# EasyEDA Pro project RCKid.epro, schematic RCKid

## Sheets
1 Power: Board Name: RCKid; Create Date: 2025-07-24; Page Name: Power; Project Name: rckid-III; Schematic Name: RCKid; Update Date: 2025-07-24; Company: EasyEDA.com; Drawed: EasyEDAPro; Page Size: A4; Part Number: JLCPCB-002; Reviewed: EasyEDAPro; Version: V0.1
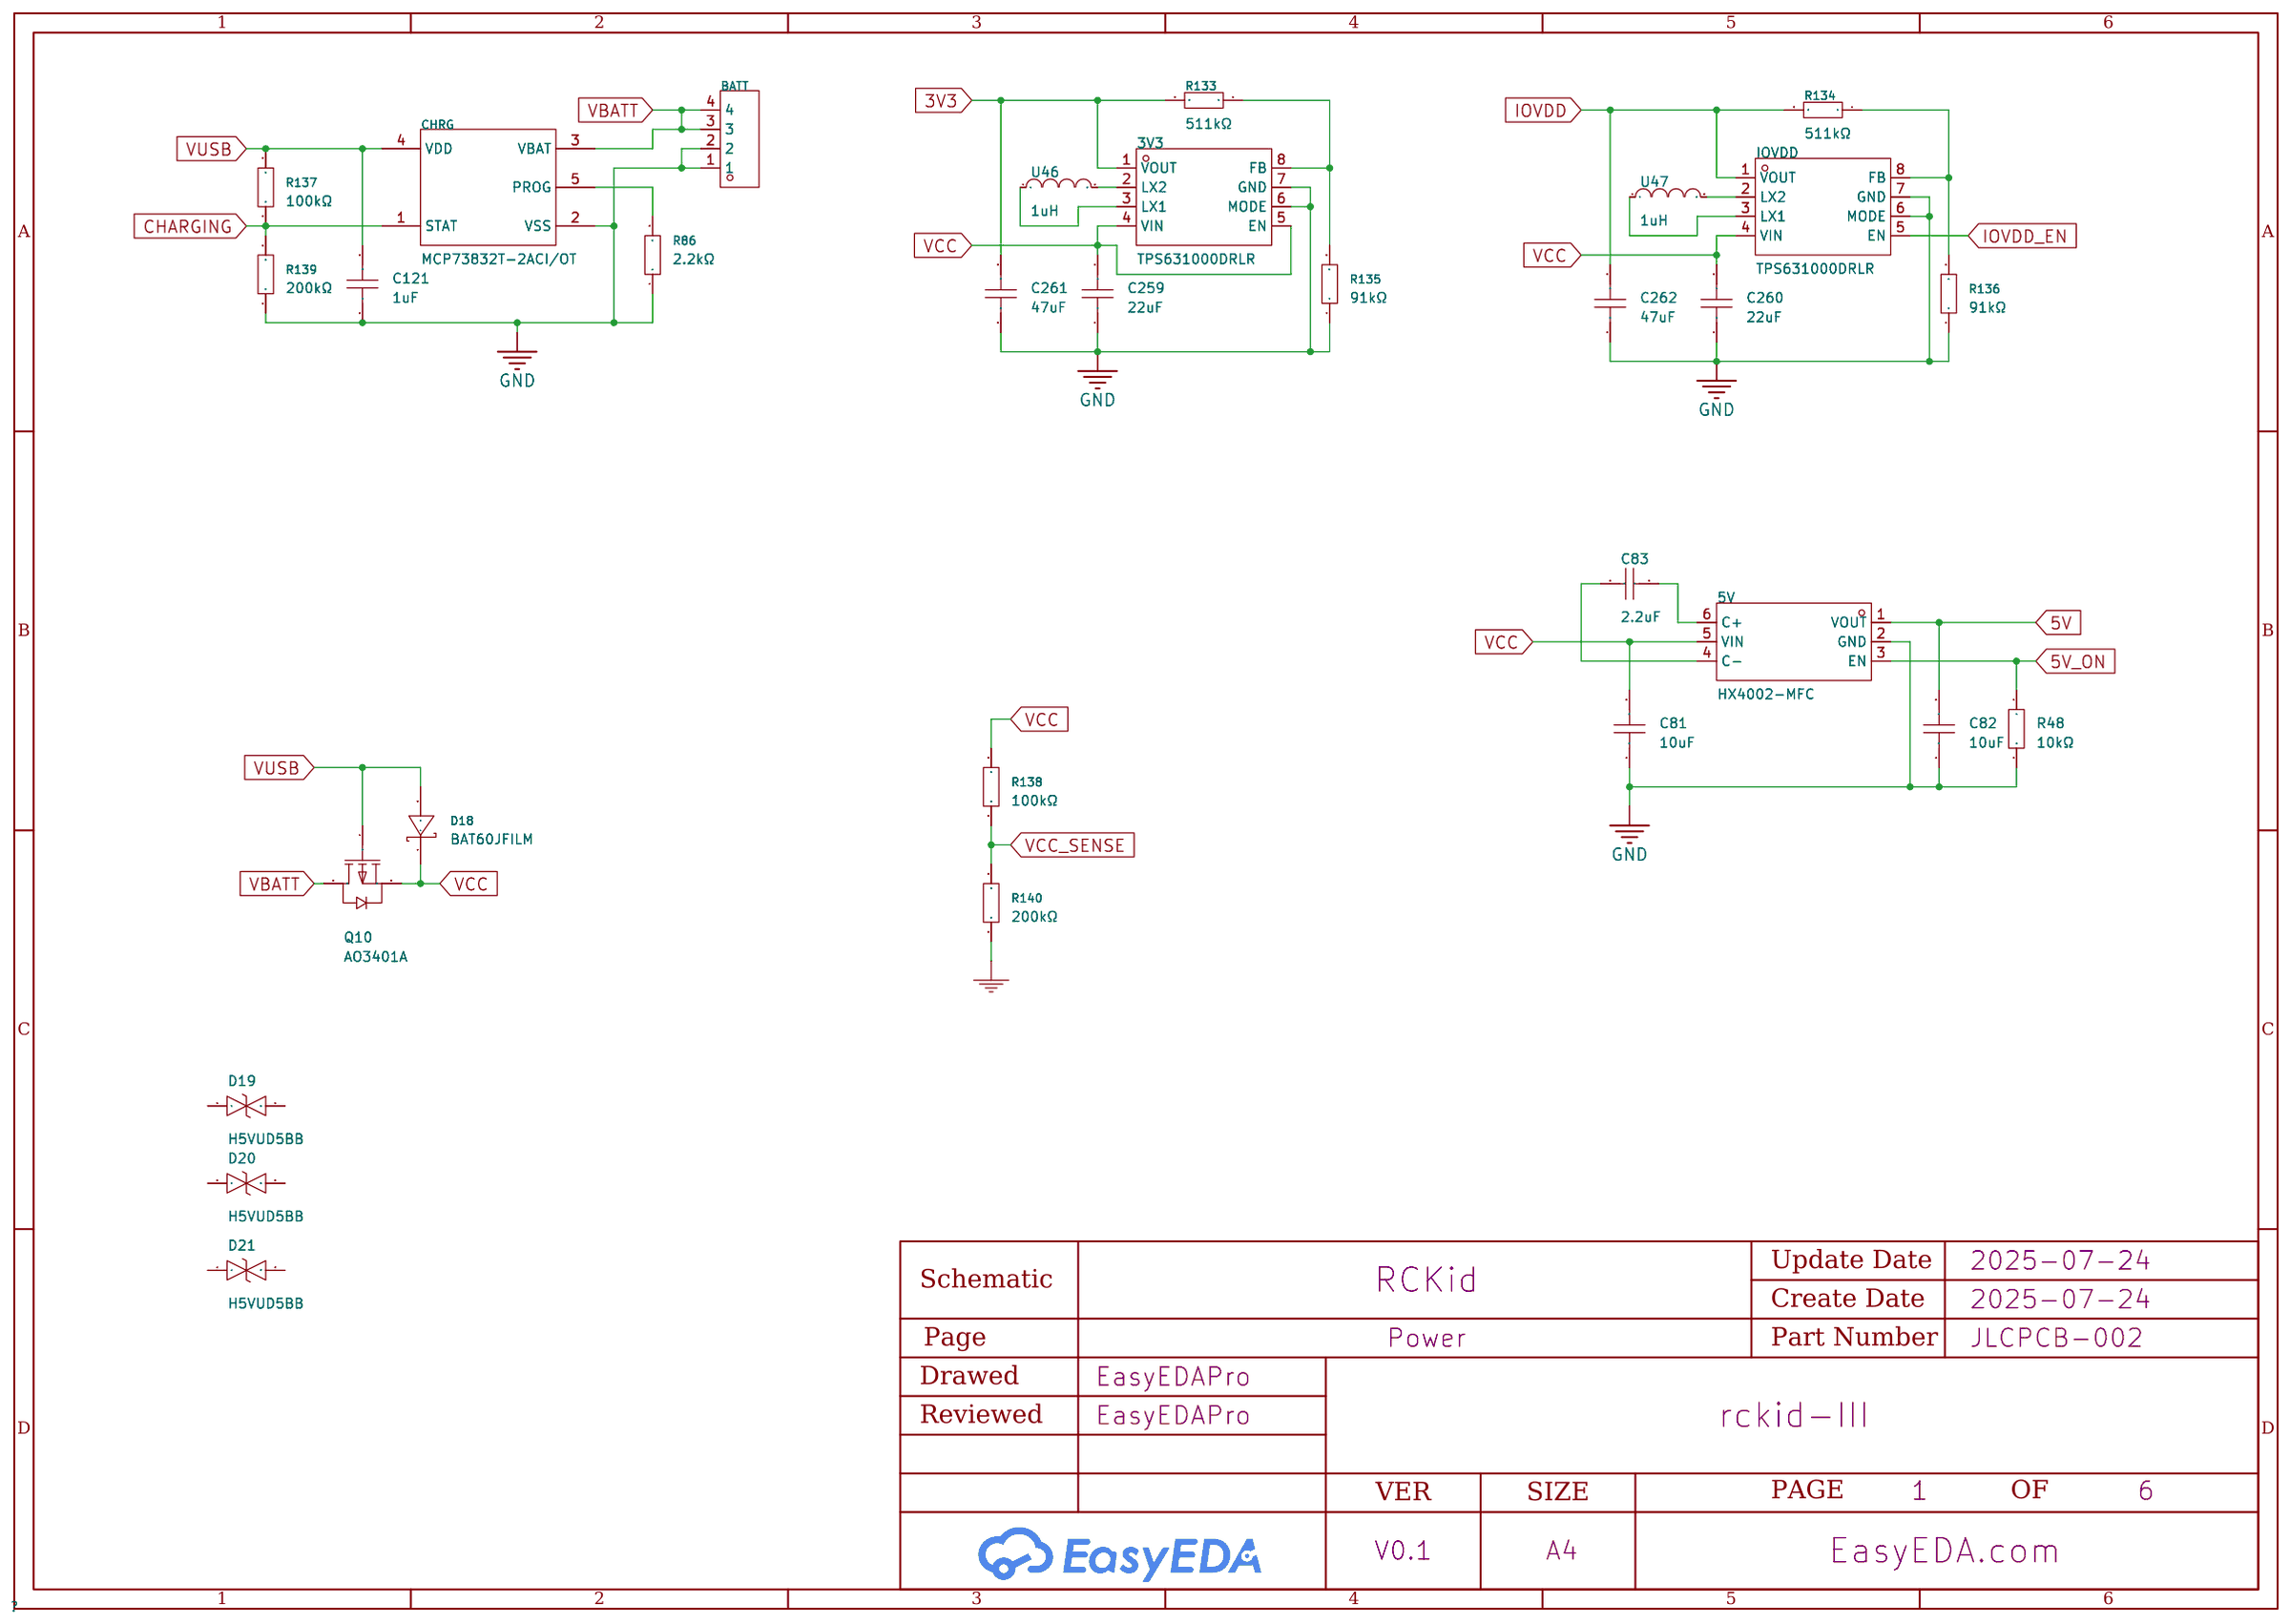
[diagram p13: Power]
2 Logic: Page Name: Logic; Update Date: 2025-07-25
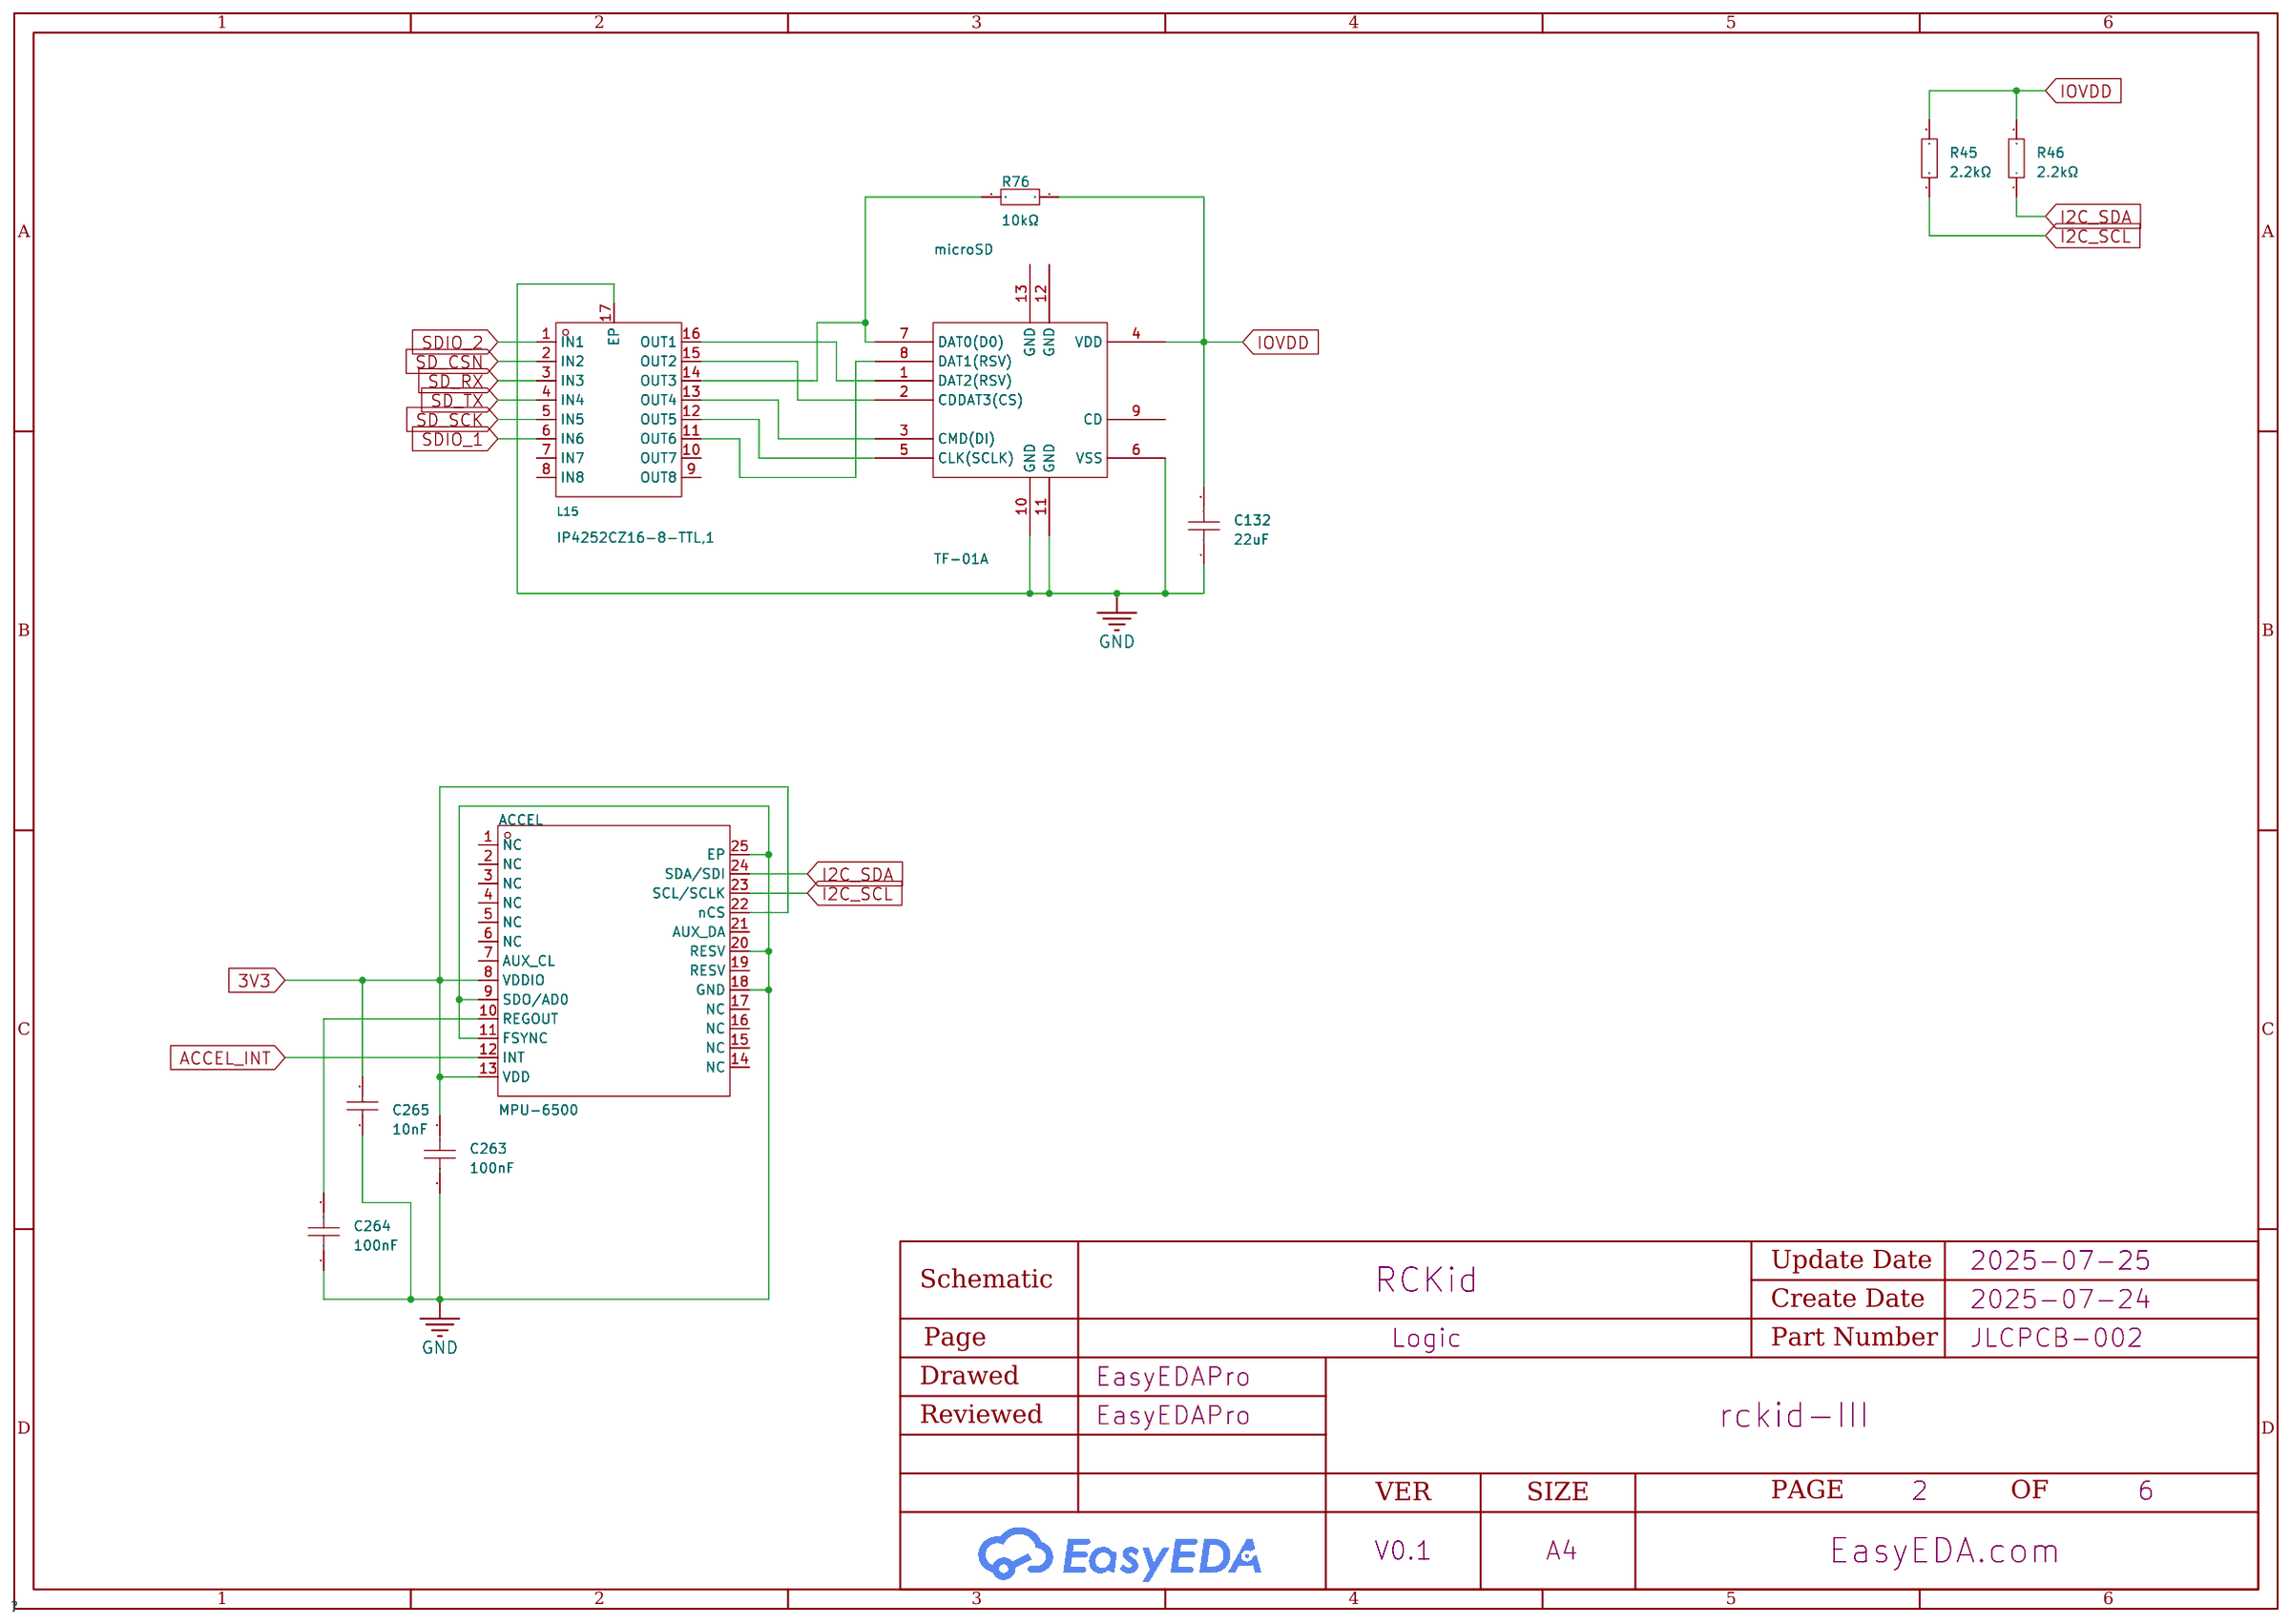
[diagram p14: Logic]
3 Audio: Page Name: Audio; Update Date: 2025-07-25
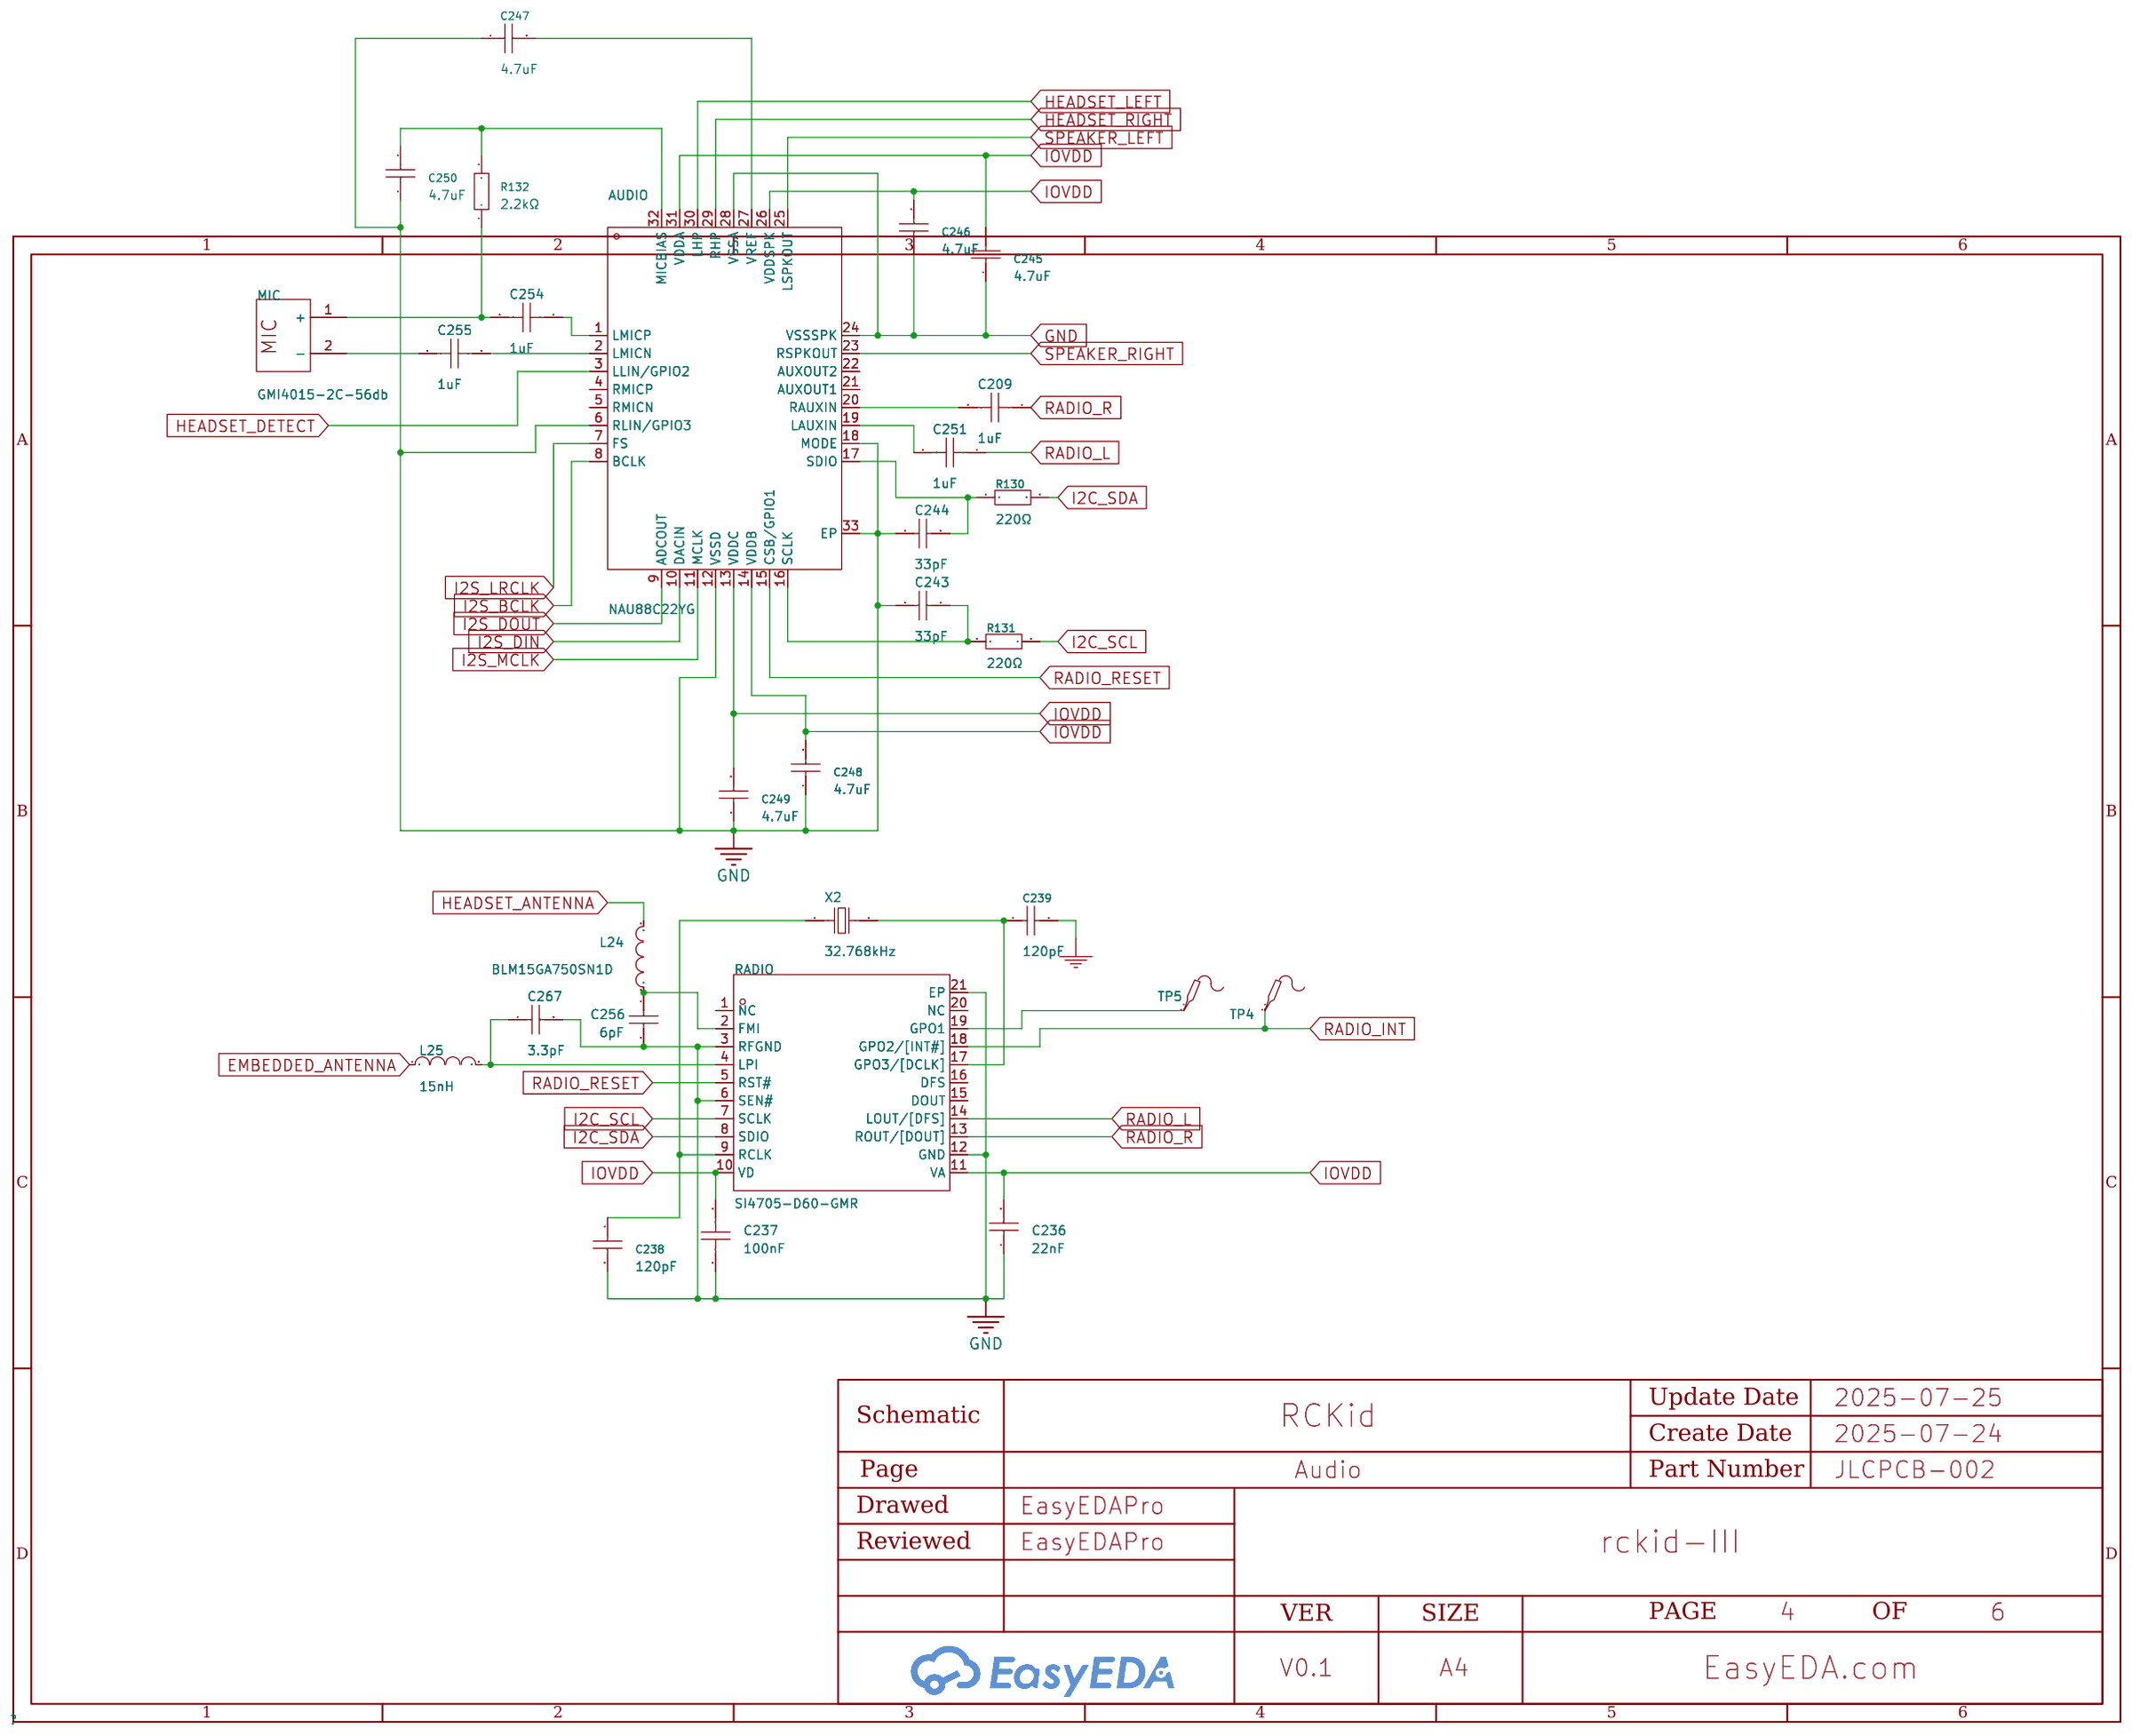
[diagram p15: Audio]
4 IO: Page Name: IO; Update Date: 2025-07-26
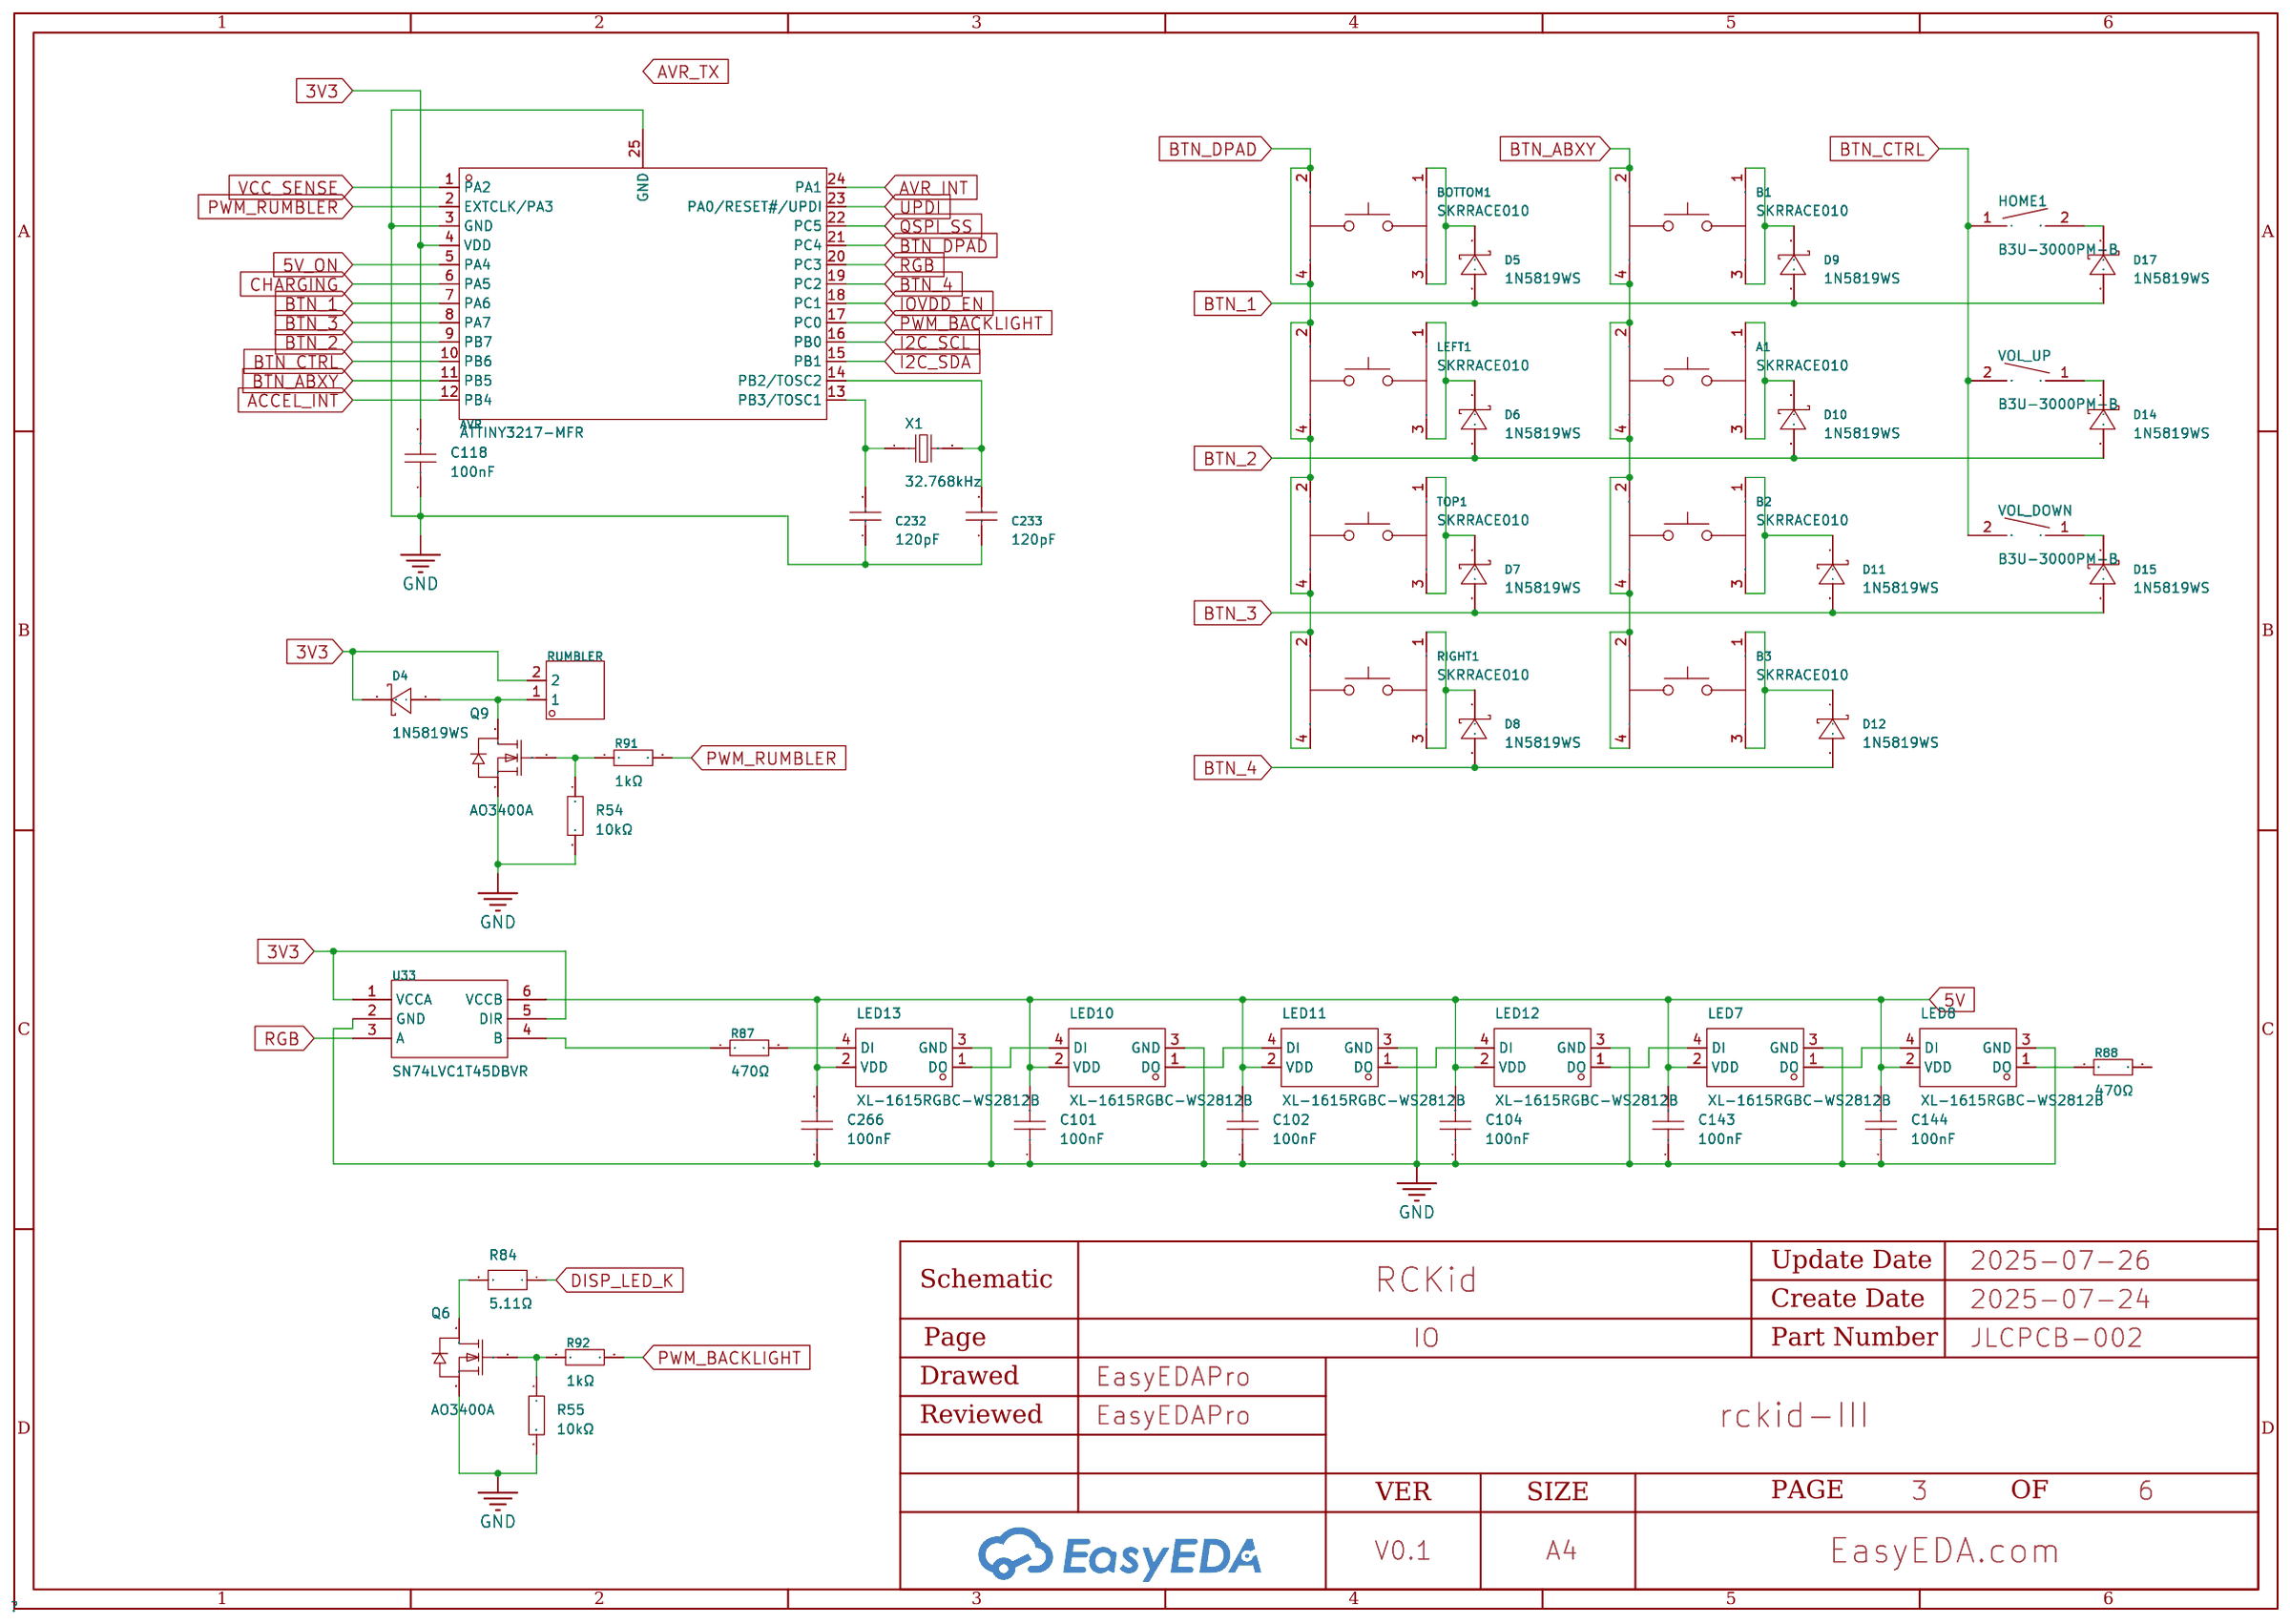
[diagram p16: IO]
5 Connectors: Page Name: Connectors; Update Date: 2025-07-27
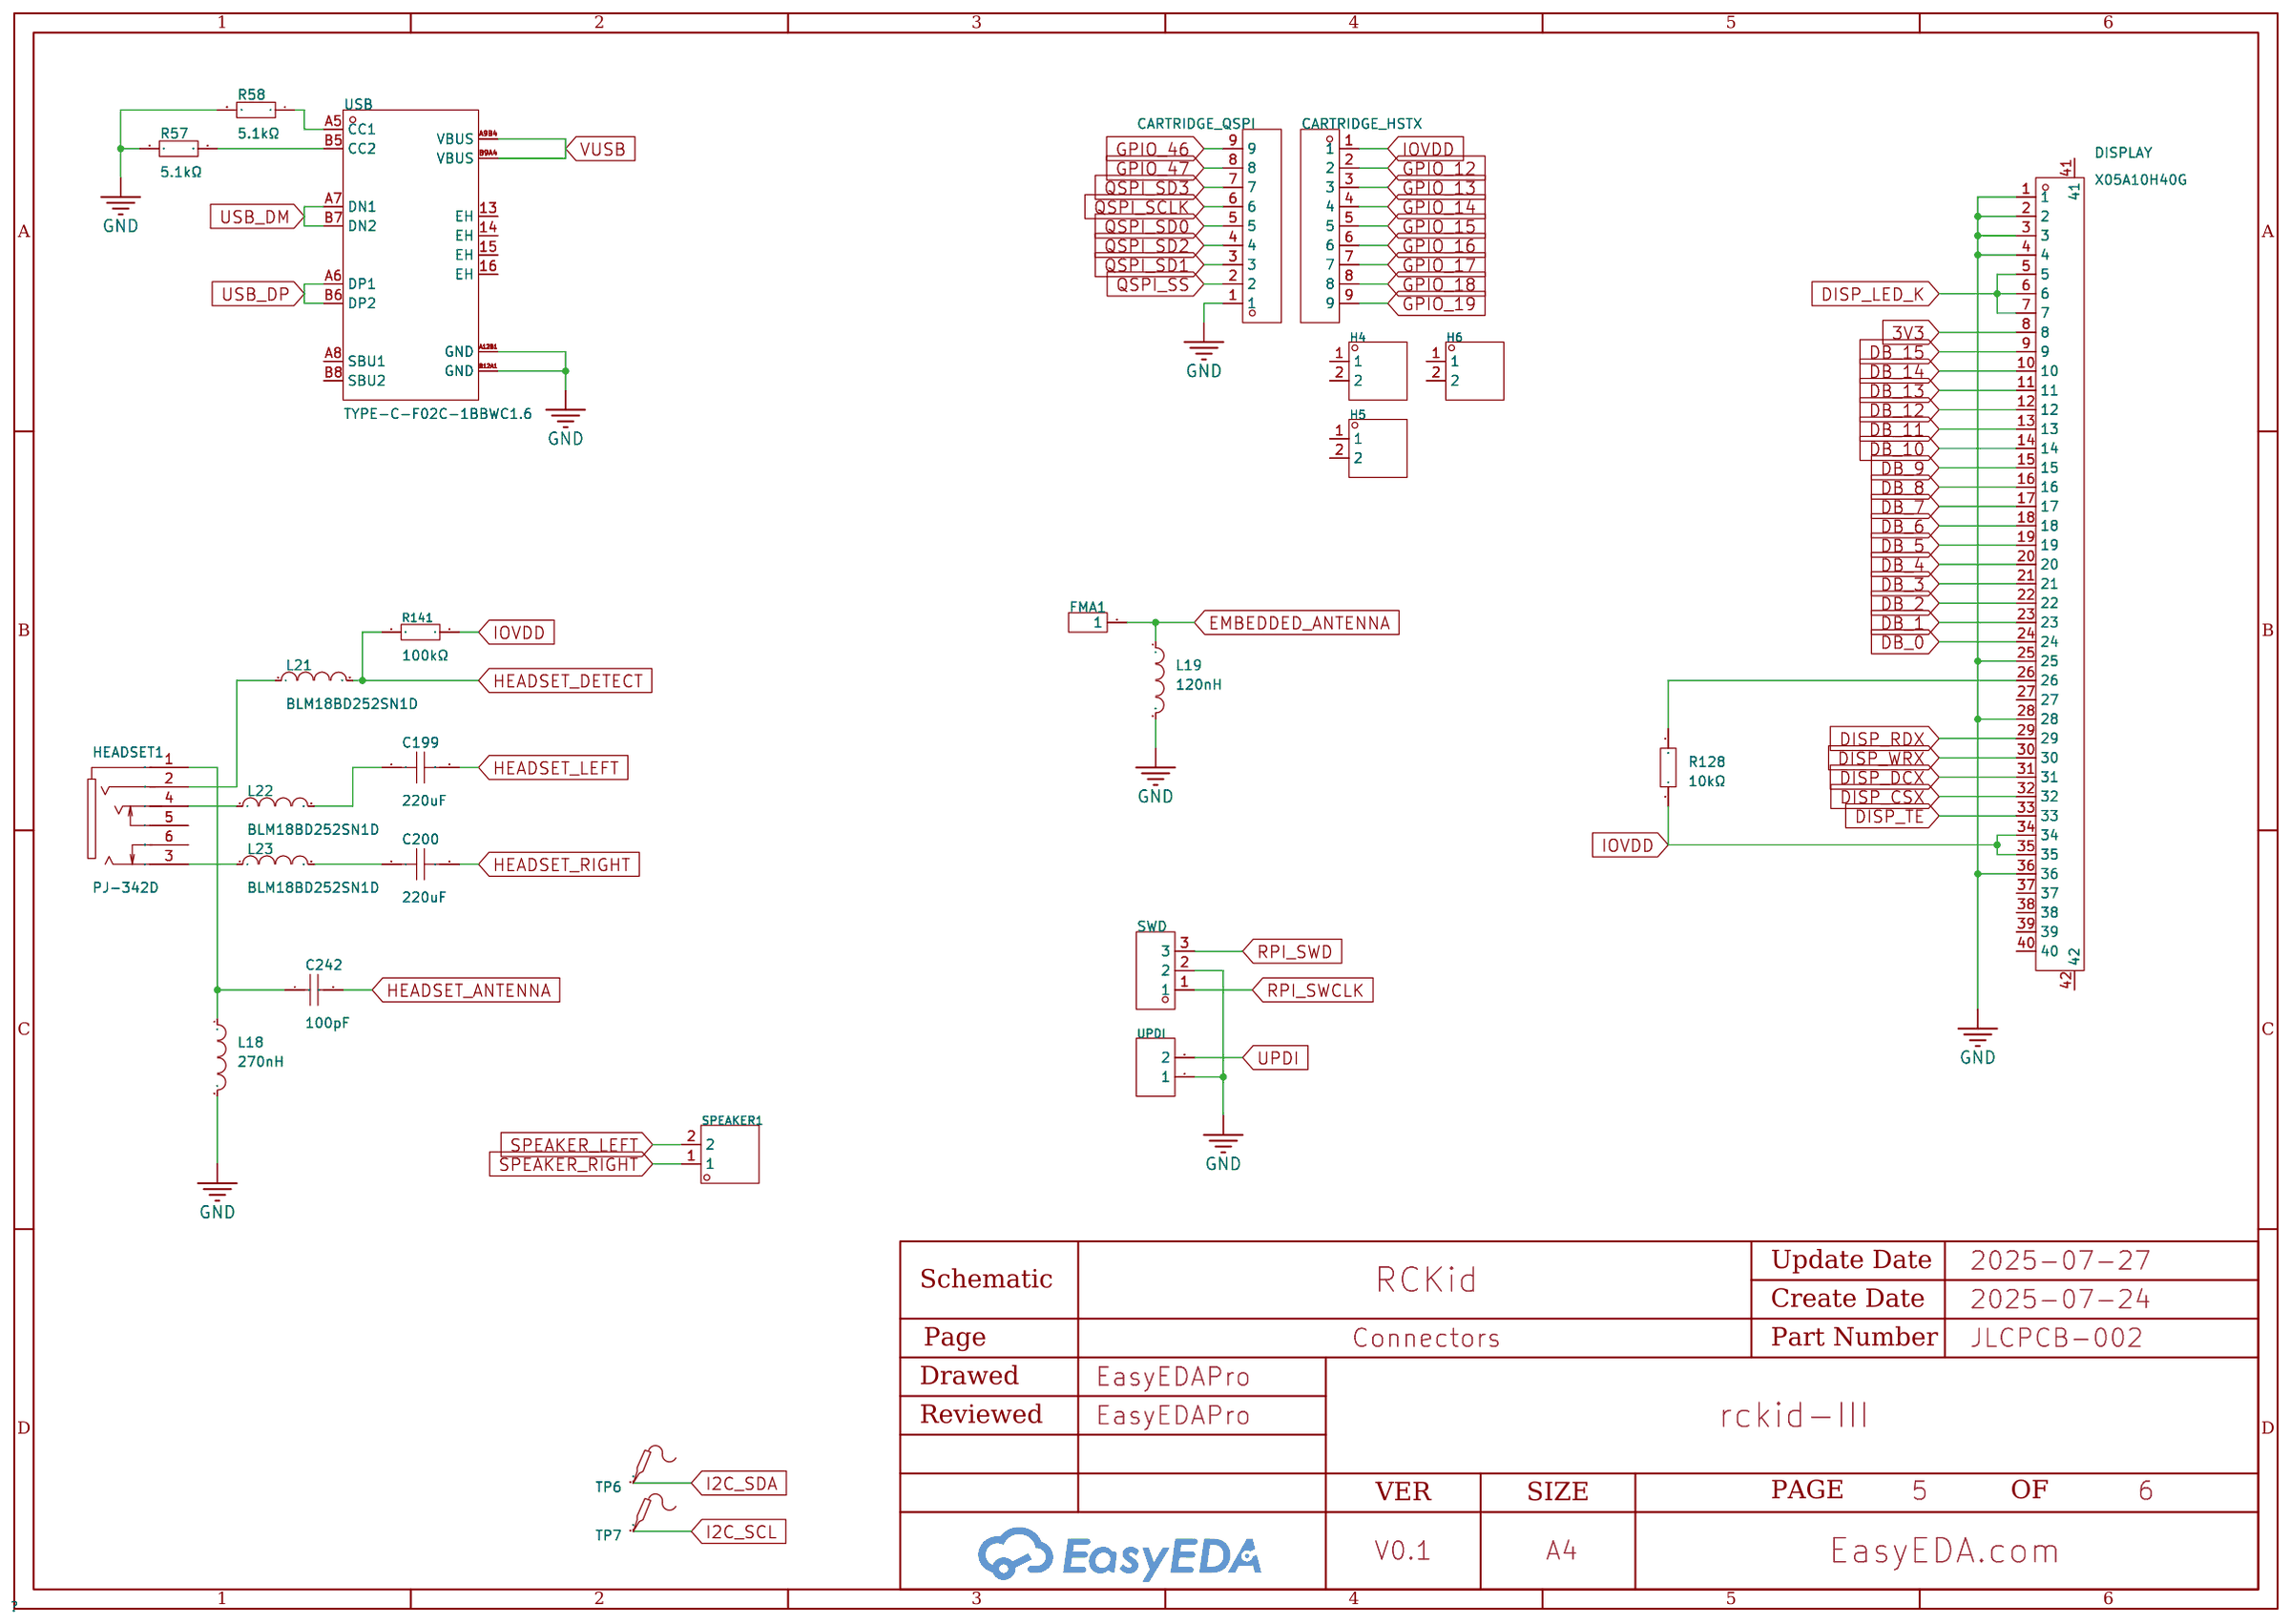
[diagram p17: Connectors]
6 RP2350: Page Name: RP2350; Update Date: 2025-07-25; Version: V1.0
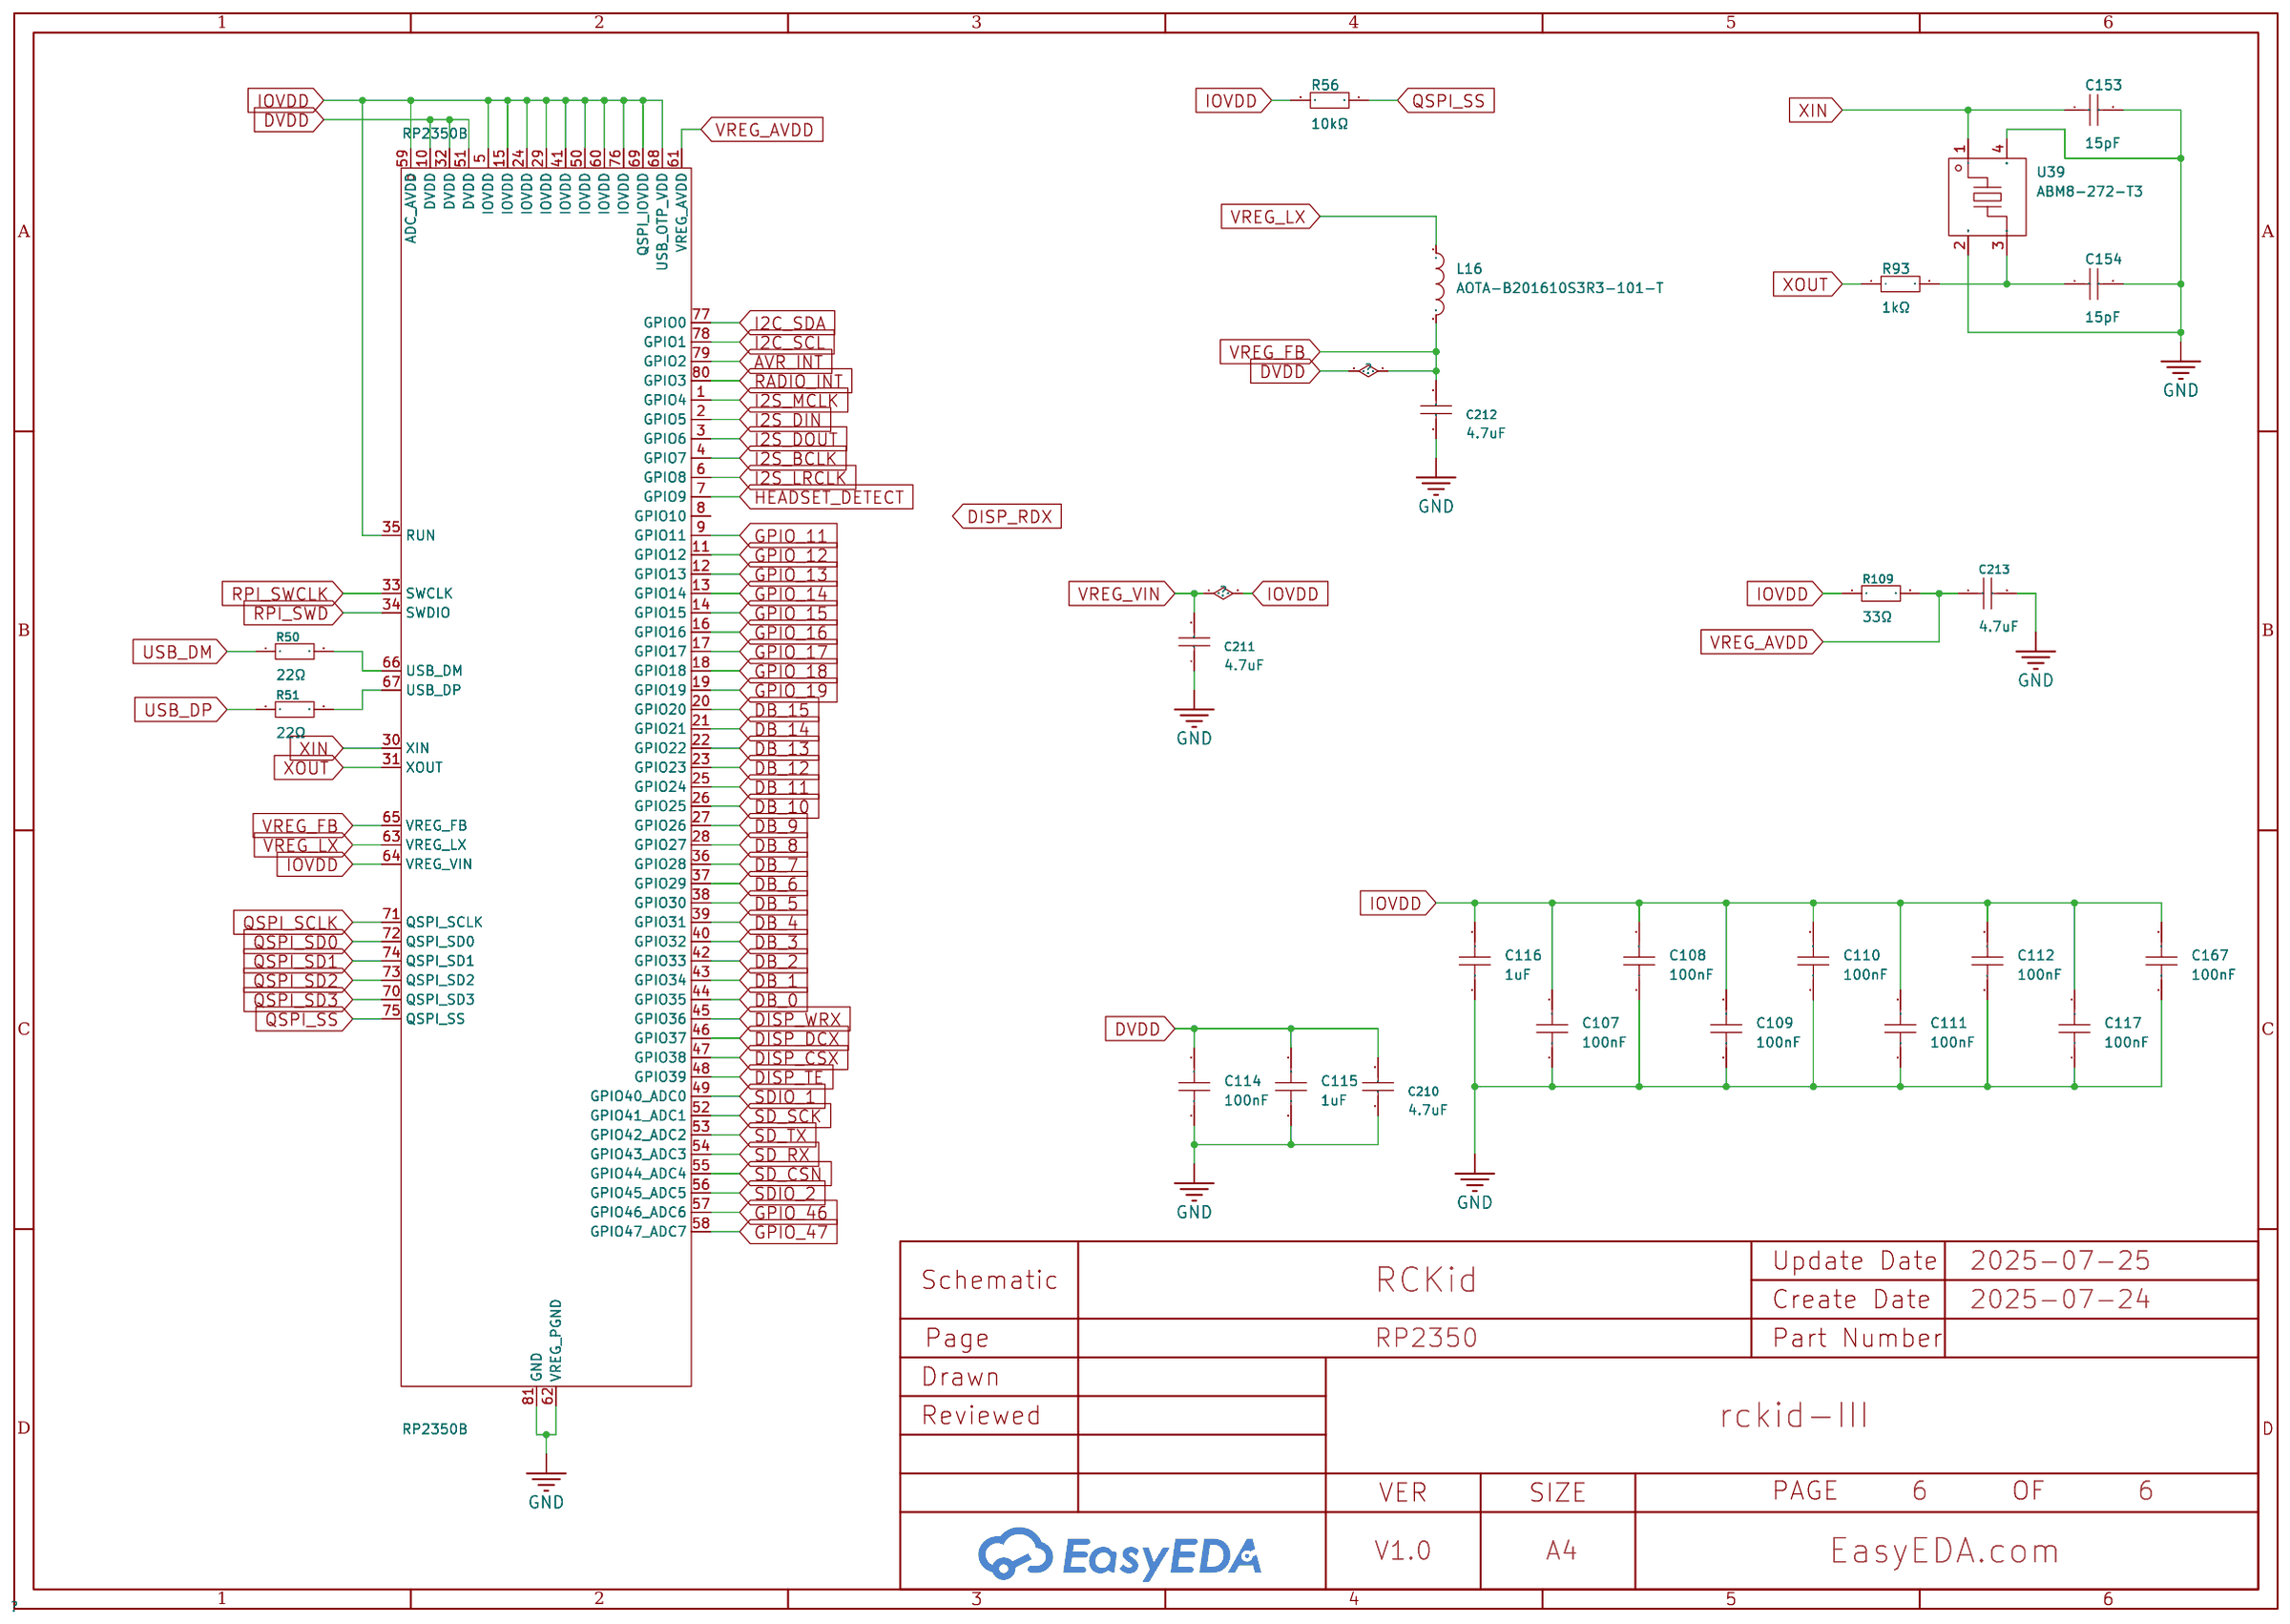
[diagram p18: RP2350]

## Parts
sheet Audio
AUDIO  NAU88C22YG  [QFN-32_L5.0-W5.0-P0.50-BL-EP2.7]
C209  1uF  [C0402]
C236  22nF  [C0402]
C237  100nF  [C0402]
C238  120pF  [C0402]
C239  120pF  [C0402]
C243  33pF  [C0402]
C244  33pF  [C0402]
C245  4.7uF  [C0402]
C246  4.7uF  [C0402]
C247  4.7uF  [C0402]
C248  4.7uF  [C0402]
C249  4.7uF  [C0402]
C250  4.7uF  [C0402]
C251  1uF  [C0402]
C254  1uF  [C0402]
C255  1uF  [C0402]
C256  6pF  [C0402]
C267  3.3pF  [C0402]
L24  BLM15GA750SN1D  [L0402]
L25  15nH  [L0402]
MIC  GMI4015-2C-56db  [MIC-SMD_BD4.0_GMI4015-2C-32DB]
R130  220Ω  [R0402]
R131  220Ω  [R0402]
R132  2.2kΩ  [R0402]
RADIO  SI4705-D60-GMR  [QFN-20_L3.0-W3.0-P0.50-TL-EP1.7_SILICON-LABS_SI4X55]
TP4  -  [TESTPOINT-SMD_BD1.5_P70-5000045R]
TP5  -  [TESTPOINT-SMD_BD1.5_P70-5000045R]
X2  32.768kHz  [FC-135R_L3.2-W1.5]
sheet Connectors
C199  220uF  [C1206]
C200  220uF  [C1206]
C242  100pF  [C0402]
CARTRIDGE_HSTX  -  [HDR-TH_9P-P2.54-V-M]  (no BOM)
CARTRIDGE_QSPI  -  [HDR-TH_9P-P2.54-V-M]  (no BOM)
DISPLAY  X05A10H40G  [FPC-SMD_X05A10H40G]
FMA1  -  [HDR-TH_1P-V-M_XKB_X4611WV-01I-C28D40]
H4  -  [HDR-TH_2P-P2.54-V-M-1]  (no BOM)
H5  -  [HDR-TH_2P-P2.54-V-M-1]  (no BOM)
H6  -  [HDR-TH_2P-P2.54-V-M-1]  (no BOM)
HEADSET1  PJ-342D  [AUDIO-SMD_PJ-342D]
L18  270nH  [L0603]
L19  120nH  [L0805]
L21  BLM18BD252SN1D  [L0603]
L22  BLM18BD252SN1D  [L0603]
L23  BLM18BD252SN1D  [L0603]
R57  5.1kΩ  [R0402]
R58  5.1kΩ  [R0402]
R128  10kΩ  [R0402]
R141  100kΩ  [R0402]
SPEAKER1  -  [SMT wire pad (2)]
SWD  -  [HDR-TH_3P-P2.54-V-F]  (no BOM)
TP6  -  [TESTPOINT-SMD_BD1.5_P70-5000045R]
TP7  -  [TESTPOINT-SMD_BD1.5_P70-5000045R]
UPDI  -  [HDR-TH_2P-P2.54-V-F]  (no BOM)
USB  TYPE-C-F02C-1BBWC1.6  [USB-C-SMD_TYPE-C-F02C-1BBWC1.6]
sheet IO
A1  SKRRACE010  [KEY-SMD_4P-L7.5-W7.0-P5.00-TL]
AVR  ATTINY3217-MFR  [WQFN-24_L4.0-W4.0-P0.50-TL-EP2.6]
B1  SKRRACE010  [KEY-SMD_4P-L7.5-W7.0-P5.00-TL]
B2  SKRRACE010  [KEY-SMD_4P-L7.5-W7.0-P5.00-TL]
B3  SKRRACE010  [KEY-SMD_4P-L7.5-W7.0-P5.00-TL]
BOTTOM1  SKRRACE010  [KEY-SMD_4P-L7.5-W7.0-P5.00-TL]
C101  100nF  [C0402]
C102  100nF  [C0402]
C104  100nF  [C0402]
C118  100nF  [C0402]
C143  100nF  [C0402]
C144  100nF  [C0402]
C232  120pF  [C0402]
C233  120pF  [C0402]
C266  100nF  [C0402]
D4  1N5819WS  [SOD-323_L1.8-W1.3-LS2.5-RD]
D5  1N5819WS  [SOD-323_L1.8-W1.3-LS2.5-RD]
D6  1N5819WS  [SOD-323_L1.8-W1.3-LS2.5-RD]
D7  1N5819WS  [SOD-323_L1.8-W1.3-LS2.5-RD]
D8  1N5819WS  [SOD-323_L1.8-W1.3-LS2.5-RD]
D9  1N5819WS  [SOD-323_L1.8-W1.3-LS2.5-RD]
D10  1N5819WS  [SOD-323_L1.8-W1.3-LS2.5-RD]
D11  1N5819WS  [SOD-323_L1.8-W1.3-LS2.5-RD]
D12  1N5819WS  [SOD-323_L1.8-W1.3-LS2.5-RD]
D14  1N5819WS  [SOD-323_L1.8-W1.3-LS2.5-RD]
D15  1N5819WS  [SOD-323_L1.8-W1.3-LS2.5-RD]
D17  1N5819WS  [SOD-323_L1.8-W1.3-LS2.5-RD]
HOME1  B3U-3000PM-B  [KEY-SMD_B3U-3000PM-B]
LED7  XL-1615RGBC-WS2812B  [LED-SMD_4P-L1.6-W1.5_XL-1615RGBC-WS2812B]
LED8  XL-1615RGBC-WS2812B  [LED-SMD_4P-L1.6-W1.5_XL-1615RGBC-WS2812B]
LED10  XL-1615RGBC-WS2812B  [LED-SMD_4P-L1.6-W1.5_XL-1615RGBC-WS2812B]
LED11  XL-1615RGBC-WS2812B  [LED-SMD_4P-L1.6-W1.5_XL-1615RGBC-WS2812B]
LED12  XL-1615RGBC-WS2812B  [LED-SMD_4P-L1.6-W1.5_XL-1615RGBC-WS2812B]
LED13  XL-1615RGBC-WS2812B  [LED-SMD_4P-L1.6-W1.5_XL-1615RGBC-WS2812B]
LEFT1  SKRRACE010  [KEY-SMD_4P-L7.5-W7.0-P5.00-TL]
Q6  AO3400A  [SOT-23-3_L2.9-W1.6-P1.90-LS2.8-BR]
Q9  AO3400A  [SOT-23-3_L2.9-W1.6-P1.90-LS2.8-BR]
R54  10kΩ  [R0402]
R55  10kΩ  [R0402]
R84  5.11Ω  [R0402]
R87  470Ω  [R0402]
R88  470Ω  [R0402]
R91  1kΩ  [R0402]
R92  1kΩ  [R0402]
RIGHT1  SKRRACE010  [KEY-SMD_4P-L7.5-W7.0-P5.00-TL]
RUMBLER  -  [SMT wire pad (2)]
TOP1  SKRRACE010  [KEY-SMD_4P-L7.5-W7.0-P5.00-TL]
U33  SN74LVC1T45DBVR  [SOT-23-6_L2.9-W1.6-P0.95-LS2.8-BR]
VOL_DOWN  B3U-3000PM-B  [KEY-SMD_B3U-3000PM-B]
VOL_UP  B3U-3000PM-B  [KEY-SMD_B3U-3000PM-B]
X1  32.768kHz  [FC-135R_L3.2-W1.5]
sheet Logic
ACCEL  MPU-6500  [QFN-24_L3.0-W3.0-P0.40-BL-EP]
C132  22uF  [C0603]
C263  100nF  [C0402]
C264  100nF  [C0402]
C265  10nF  [C0402]
L15  IP4252CZ16-8-TTL,1  [UDFN-16_L3.3-W1.4-P0.40-BL-EP]
microSD  TF-01A  [TF-SMD_TF-01A]
R45  2.2kΩ  [R0402]
R46  2.2kΩ  [R0402]
R76  10kΩ  [R0402]
sheet Power
3V3  TPS631000DRLR  [SOT-583-8_L2.1-W1.2-P0.50-LS1.6-BL]
5V  HX4002-MFC  [SOT-23-6_L2.9-W1.6-P0.95-LS2.8-BR]
BATT  -  [HDR-TH_4P-P2.54-V-M]
C81  10uF  [C0603]
C82  10uF  [C0603]
C83  2.2uF  [C0603]
C121  1uF  [C0402]
C259  22uF  [C0603]
C260  22uF  [C0603]
C261  47uF  [C0603]
C262  47uF  [C0603]
CHRG  MCP73832T-2ACI/OT  [SOT-23-5_L3.0-W1.7-P0.95-LS2.8-BR]
D18  BAT60JFILM  [SOD-323_L1.8-W1.3-LS2.5-RD]
D19  H5VUD5BB  [SOD-523_L1.2-W0.8-LS1.6-BI]
D20  H5VUD5BB  [SOD-523_L1.2-W0.8-LS1.6-BI]
D21  H5VUD5BB  [SOD-523_L1.2-W0.8-LS1.6-BI]
IOVDD  TPS631000DRLR  [SOT-583-8_L2.1-W1.2-P0.50-LS1.6-BL]
Q10  AO3401A  [SOT-23_L2.9-W1.3-P1.90-LS2.4-BR]
R48  10kΩ  [R0402]
R86  2.2kΩ  [R0402]
R133  511kΩ  [R0402]
R134  511kΩ  [R0402]
R135  91kΩ  [R0402]
R136  91kΩ  [R0402]
R137  100kΩ  [R0402]
R138  100kΩ  [R0402]
R139  200kΩ  [R0402]
R140  200kΩ  [R0402]
U46  1uH  [L1008]
U47  1uH  [L1008]
sheet RP2350
C107  100nF  [C0402]
C108  100nF  [C0402]
C109  100nF  [C0402]
C110  100nF  [C0402]
C111  100nF  [C0402]
C112  100nF  [C0402]
C114  100nF  [C0402]
C115  1uF  [C0402]
C116  1uF  [C0402]
C117  100nF  [C0402]
C153  15pF  [C0402]
C154  15pF  [C0402]
C167  100nF  [C0402]
C210  4.7uF  [C0402]
C211  4.7uF  [C0402]
C212  4.7uF  [C0402]
C213  4.7uF  [C0402]
L16  AOTA-B201610S3R3-101-T  [IND-SMD_L2.0-W1.6_AOTA-B201610S3R3-101-T]
R50  22Ω  [R0402]
R51  22Ω  [R0402]
R56  10kΩ  [R0402]
R93  1kΩ  [R0402]
R109  33Ω  [R0402]
RP2350B  RP2350B  [QFN-80_L10.0-W10.0-P0.40-TL-EP3.4]
U39  ABM8-272-T3  [CRYSTAL-SMD_4P-L3.2-W2.5-BL]

## Library data of the parts
AUDIO = NAU88C22YG_C914209: LCSC Part Name: 24-bit Stereo Audio Codec with Speaker Driver; Supplier Part: C914209; Manufacturer: NUVOTON(新唐); Supplier Footprint: QFN-32-EP(5x5); JLCPCB Part Class: Extended Part; Datasheet: https://atta.szlcsc.com/upload/public/pdf/source/20170606/1496716392241.pdf; Supplier: LCSC
C115 C116 C121 C209 C251 C254 C255 = CL05A105KA5NQNC: Capacitance: Tolerance:±10% Tolerance:±10% Voltage Rated: Temperature Coefficient:; LCSC Part Name: 1uF±10%25V; Supplier Part: C52923; Manufacturer: SAMSUNG(三星); Supplier Footprint: 0402; JLCPCB Part Class: BasicPart; Datasheet: https://atta.szlcsc.com/upload/public/pdf/source/20160103/1457707735223.pdf; Supplier: LCSC; Tolerance: ±10%
C236 = 0402B223K500NT: Capacitance:22nF Tolerance:±10% Tolerance:±10% Voltage Rated: Temperature Coefficient:; LCSC Part Name: 22nF ±10% 50V; Supplier Part: C1532; Manufacturer: FH(风华); Supplier Footprint: 0402; JLCPCB Part Class: Basic Part; Datasheet: https://atta.szlcsc.com/upload/public/pdf/source/20200305/C486355_26A10D38EF8C2A5C37091D0039909270.pdf; Supplier: LCSC; Tolerance: ±10%
C101 C102 C104 C107-C112 C114 C117 C118 C143 C144 C167 C237 C263 C264 C266 = CL05B104KB54PNC: Capacitance: Tolerance:±10% Tolerance:±10% Voltage Rated: Temperature Coefficient:; LCSC Part Name: 100nF ±10% 50V; Supplier Part: C307331; Manufacturer: SAMSUNG(三星); Supplier Footprint: 0402; JLCPCB Part Class: Basic Part; Datasheet: https://atta.szlcsc.com/upload/public/pdf/source/20181009/C307331_222F7C870FD3EA5F46F538B483443886.pdf; Supplier: LCSC; Tolerance: ±10%
C232 C233 C238 C239 = CC0402JRNPO9BN121: Capacitance: Tolerance:±5% Tolerance:±5% Voltage Rated: Temperature Coefficient:; LCSC Part Name: 120pF ±5% 50V; Supplier Part: C106996; Manufacturer: YAGEO(国巨); Supplier Footprint: 0402; JLCPCB Part Class: Extended Part; Datasheet: https://atta.szlcsc.com/upload/public/pdf/source/20170914/C128857_1505359892143968080.pdf; Supplier: LCSC; Tolerance: ±5%
C243 C244 = 0402CG330J500NT: Capacitance: Tolerance:±5% Tolerance:±5% Voltage Rated: Temperature Coefficient:; LCSC Part Name: 33pF ±5% 50V; Supplier Part: C1562; Manufacturer: FH(风华); Supplier Footprint: 0402; JLCPCB Part Class: Basic Part; Datasheet: https://atta.szlcsc.com/upload/public/pdf/source/20200305/C486355_26A10D38EF8C2A5C37091D0039909270.pdf; Supplier: LCSC; Tolerance: ±5%
C210-C213 C245-C250 = CL05A475MP5NRNC: Capacitance: Tolerance:±20% Tolerance:±20% Voltage Rated: Temperature Coefficient:; LCSC Part Name: 4.7uF±20%10V; Supplier Part: C23733; Manufacturer: SAMSUNG(三星); Supplier Footprint: 0402; JLCPCB Part Class: BasicPart; Datasheet: https://atta.szlcsc.com/upload/public/pdf/source/20160103/1457707710457.pdf; Supplier: LCSC; Tolerance: ±20%
C256 = 0402CG6R0C500NT (SMT业务专用): LCSC Part Name: ±0.25pF; Supplier Part: C30274; Manufacturer: FH(风华); Supplier Footprint: 0402; JLCPCB Part Class: Extended Part; Datasheet: https://atta.szlcsc.com/upload/public/pdf/source/20200305/C486355_26A10D38EF8C2A5C37091D0039909270.pdf; Supplier: LCSC
C267 = 0402CG3R3C500NT: Capacitance:3.3pF Voltage Rating:50V Temperature Coefficient:C0G; LCSC Part Name: ±0.25pF 3.3pF 50V; Supplier Part: C1565; Manufacturer: FH(风华); Supplier Footprint: 0402; JLCPCB Part Class: Extended Part; Datasheet: https://atta.szlcsc.com/upload/public/pdf/source/20200305/C486355_26A10D38EF8C2A5C37091D0039909270.pdf; Supplier: LCSC; Voltage Rating: 50V; Temperature Coefficient: C0G
L24 = BLM15GA750SN1D: Impedance @ Frequency:75Ω@100MHz Tolerance:±25% Tolerance:±25% DC Resistance:1.3Ω Current Rating:200mA Circuits:1; LCSC Part Name: 单路 0402磁珠 阻抗75Ω@100MHz; Supplier Part: C113009; Manufacturer: muRata(村田); Supplier Footprint: 0402; JLCPCB Part Class: Extended Part; Datasheet: https://atta.szlcsc.com/upload/public/pdf/source/20170523/1495533951689.pdf; Supplier: LCSC; Impedance @ Frequency: 75Ω@100MHz; Tolerance: ±25%; DC Resistance: 1.3Ω; Current Rating: 200mA; Circuits: 1
L25 = SDCL1005C15NJTDF_C27143: Inductance: Tolerance:±5% Tolerance:±5% Rated Current: Current - Saturation (Isat):- DC Resistance(DCR): Q @ Frequency:8@100MHz Frequency - Self Resonant: Ratings:; LCSC Part Name: 15nH ±5%; Supplier Part: C27143; Manufacturer: Sunlord(顺络); Manufacturer Part: SDCL1005C15NJTDF; Supplier Footprint: 0402; JLCPCB Part Class: Extended Part; Datasheet: https://atta.szlcsc.com/upload/public/pdf/source/20231027/6126A3AAC5912C34388756BE22DEE00C.pdf; Supplier: LCSC; Tolerance: ±5%; Q @ Frequency: 8@100MHz
MIC = GMI4015-2C-56db: LCSC Part Name: 全指向双电容φ4.0*1.5mm 1.5V-10V 灵敏度-56dB 低阻抗; Supplier Part: C233280; Manufacturer: INGHAi(赢海); JLCPCB Part Class: Extended Part; Datasheet: https://atta.szlcsc.com/upload/public/pdf/source/20180613/C233285_B82B48E7113DD15BB0DB65002027213C.pdf; Supplier: LCSC
R130 R131 = 0402WGF2200TCE: Resistance: Tolerance:±1% Tolerance:±1% Power(Watts): Overload Voltage (Max): Temperature Coefficient:±100ppm/℃ Temperature Coefficient:±100ppm/℃ Type:Thick Film Resistors Operating Temperature Range:-55℃~+155℃ Operating Temperature Range:-55℃~+155℃; LCSC Part Name: 220Ω ±1% 62.5mW 厚膜电阻; Supplier Part: C25091; Manufacturer: UNI-ROYAL(厚声); Supplier Footprint: 0402; JLCPCB Part Class: Basic Part; Datasheet: https://atta.szlcsc.com/upload/public/pdf/source/20200306/C422600_1E6D84923E4A46A82E41ADD87F860B5C.pdf; Supplier: LCSC; Tolerance: ±1%; Temperature Coefficient: ±100ppm/℃; Type: Thick Film Resistors; Operating Temperature Range: -55℃~+155℃
R45 R46 R86 R132 = 0402WGF2201TCE: Type:Thick Film Resistors Resistance: Tolerance:±1% Tolerance:±1% Power(Watts): Temperature Coefficient:±100ppm/℃ Temperature Coefficient:±100ppm/℃ Overload Voltage (Max): Operating Temperature Range:-55℃~+155℃ Operating Temperature Range:-55℃~+155℃; LCSC Part Name: 2.2kΩ±1%62.5mW; Supplier Part: C25879; Manufacturer: UNI-ROYAL(厚声); Supplier Footprint: 0402; JLCPCB Part Class: BasicPart; Datasheet: https://atta.szlcsc.com/upload/public/pdf/source/20200306/C422600_1E6D84923E4A46A82E41ADD87F860B5C.pdf; Supplier: LCSC; Type: ThickFilmResistors; Tolerance: ±1%; Temperature Coefficient: ±100ppm/℃; Operating Temperature Range: -55℃~+155℃
RADIO = SI4705-D60-GMR: Supplier Part: C2654632; Manufacturer: SKYWORKS/SILICON LABS(芯科); Supplier Footprint: QFN-20-EP(3x3); JLCPCB Part Class: Extended Part; Datasheet: https://atta.szlcsc.com/upload/public/pdf/source/20210603/097935DFE49676B16CAB25B24893A3FB.pdf; Supplier: LCSC
TP4-TP7 = Test-Point: Test Point 测试点
X1 X2 = Q13FC13500004_C32346: Crystal Type:Surface Mount Crystal Frequency: Normal temperature Frequency Tolerance:±20ppm Normal temperature Frequency Tolerance:±20ppm Load Capacitor: Equivalent Series Resistance (ESR):70kΩ Operating Temperature: Operating Temperature:; LCSC Part Name: 32.768kHz ±20ppm 12.5pF; Supplier Part: C32346; Manufacturer: EPSON(爱普生); Manufacturer Part: Q13FC13500004; Supplier Footprint: SMD3215-2P; JLCPCB Part Class: Basic Part; Datasheet: https://atta.szlcsc.com/upload/public/pdf/source/20240418/0E0FF5F0356BA3753F616001439D1416.pdf; Supplier: LCSC; Crystal Type: Surface Mount Crystal; Normal temperature Frequency Tolerance: ±20ppm; Equivalent Series Resistance (ESR): 70kΩ
C199 C200 = GRM31CR60J227ME11L: Capacitance: Tolerance:±20% Tolerance:±20% Voltage Rated: Temperature Coefficient:; LCSC Part Name: 220uF ±20% 6.3V; Supplier Part: C412252; Manufacturer: muRata(村田); Supplier Footprint: 1206; JLCPCB Part Class: Extended Part; Datasheet: https://atta.szlcsc.com/upload/public/pdf/source/20190904/C426118_85E81C7C1F21FC87C5FB6D536E0847B4.pdf; Supplier: LCSC; Tolerance: ±20%
C242 = 0402CG101J500NT: Capacitance: Tolerance:±5% Tolerance:±5% Voltage Rated: Temperature Coefficient:; LCSC Part Name: 100pF ±5% 50V; Supplier Part: C1546; Manufacturer: FH(风华); Supplier Footprint: 0402; JLCPCB Part Class: Basic Part; Datasheet: https://atta.szlcsc.com/upload/public/pdf/source/20200305/C486355_26A10D38EF8C2A5C37091D0039909270.pdf; Supplier: LCSC; Tolerance: ±5%
CARTRIDGE_HSTX CARTRIDGE_QSPI = HDR-M_2.54-1x9P: Supplier Footprint: Through
DISPLAY = X05A10H40G: Locking Feature:Clamshell Contact Type:Double-sided contacts/up and down connection Number of Contacts:40P Pitch:0.5mm Mounting Type:卧贴 FFC, FCB Thickness:0.3mm FFC, FCB Thickness:0.3mm Height Above Board:1mm Contact Material:Phosphor bronze Contact Plati; LCSC Part Name: 间距:0.5mm P数:40P 翻盖式 双侧触点/上下接; Supplier Part: C528037; Manufacturer: XKB Connection(中国星坤); Supplier Footprint: SMD,P=0.5mm,卧贴; JLCPCB Part Class: Extended Part; Datasheet: https://atta.szlcsc.com/upload/public/pdf/source/20211011/0FF349E115430A192F511B573FCEF693.pdf; Supplier: LCSC; Locking Feature: Clamshell; Contact Type: Double-sided contacts/up and down connection; Number of Contacts: 40P; Pitch: 0.5mm; Mounting Type: 卧贴; FFC, FCB Thickness: 0.3mm; Height Above Board: 1mm; Contact Material: Phosphor bronze; Contact Plating: Gold; Operating Temperature Range: -40℃~+85℃; Soldering Temperature(Max): 260℃
FMA1 = HDR-M_2.54_1x1P: Supplier Footprint: Through
H4-H6 RUMBLER SPEAKER1 = HDR-M_2.54_1x2P: Supplier Footprint: Through
HEADSET1 = PJ-342D: Connector Type:3.5mm耳机座 Current Rating (Max):500mA Voltage Rating (Max):30V Operating Temperature Range:-20℃~+70℃ Operating Temperature Range:-20℃~+70℃ Soldering Temperature(Max):235℃; LCSC Part Name: 3.5mm耳机座; Supplier Part: C2689707; Manufacturer: XKB Connectivity(中国星坤); Supplier Footprint: SMD; JLCPCB Part Class: Extended Part; Datasheet: https://atta.szlcsc.com/upload/public/pdf/source/20211011/5410BBAF7F4CEA04F8E2A1AE1B358EC2.pdf; Supplier: LCSC; Connector Type: 3.5mm耳机座; Current Rating (Max): 500mA; Voltage Rating (Max): 30V; Operating Temperature Range: -20℃~+70℃; Soldering Temperature(Max): 235℃
L18 = MLF1608DR27JT000: Inductance: Tolerance:±5% Tolerance:±5% Rated Current: Saturation Current (Isat):- DC Resistance (DCR): Q @ Freq:15@25MHz Frequency - Self Resonant:260MHz Ratings:; LCSC Part Name: 270nH ±5%; Supplier Part: C87519; Manufacturer: TDK; Supplier Footprint: 0603; JLCPCB Part Class: Extended Part; Datasheet: https://atta.szlcsc.com/upload/public/pdf/source/20191023/C440659_C3A2993F9C3C9B25E061479B1BCAA800.pdf; Supplier: LCSC; Tolerance: ±5%; Q @ Freq: 15@25MHz; Frequency - Self Resonant: 260MHz
L19 = MLF2012DR12JT000: Inductance: Tolerance:±5% Tolerance:±5% Rated Current: Saturation Current (Isat):- DC Resistance (DCR): Q @ Freq:20@25MHz Frequency - Self Resonant:360MHz Ratings:; LCSC Part Name: 120nH ±5%; Supplier Part: C275379; Manufacturer: TDK; Supplier Footprint: 0805; JLCPCB Part Class: Extended Part; Datasheet: https://atta.szlcsc.com/upload/public/pdf/source/20190108/C360707_9A5133A313C174521C900275925A1073.pdf; Supplier: LCSC; Tolerance: ±5%; Q @ Freq: 20@25MHz; Frequency - Self Resonant: 360MHz
L21-L23 = BLM18BD252SN1D: Impedance @ Frequency:2.5kΩ@100MHz Tolerance:±25% Tolerance:±25% DC Resistance:1.5Ω Current Rating:150mA Circuits:1; LCSC Part Name: 单路 0603磁珠 阻抗2.5kΩ@100MHz; Supplier Part: C77668; Manufacturer: muRata(村田); Supplier Footprint: 0603; JLCPCB Part Class: Extended Part; Datasheet: https://atta.szlcsc.com/upload/public/pdf/source/20170721/C87063_1500619398878834175.pdf; Supplier: LCSC; Impedance @ Frequency: 2.5kΩ@100MHz; Tolerance: ±25%; DC Resistance: 1.5Ω; Current Rating: 150mA; Circuits: 1
R57 R58 = 0402WGF5101TCE: Type:Thick Film Resistors Resistance: Tolerance:±1% Tolerance:±1% Power(Watts): Temperature Coefficient:±100ppm/℃ Temperature Coefficient:±100ppm/℃ Overload Voltage (Max): Operating Temperature Range:-55℃~+155℃ Operating Temperature Range:-55℃~+155℃; LCSC Part Name: 5.1kΩ ±1% 62.5mW; Supplier Part: C25905; Manufacturer: UNI-ROYAL(厚声); Supplier Footprint: 0402; JLCPCB Part Class: Basic Part; Datasheet: https://atta.szlcsc.com/upload/public/pdf/source/20200306/C422600_1E6D84923E4A46A82E41ADD87F860B5C.pdf; Supplier: LCSC; Type: Thick Film Resistors; Tolerance: ±1%; Temperature Coefficient: ±100ppm/℃; Operating Temperature Range: -55℃~+155℃
R48 R54-R56 R76 R128 = 0402WGF1002TCE: Type:Thick Film Resistors Resistance: Tolerance:±1% Tolerance:±1% Power(Watts): Temperature Coefficient:±100ppm/℃ Temperature Coefficient:±100ppm/℃ Overload Voltage (Max): Operating Temperature Range:-55℃~+155℃ Operating Temperature Range:-55℃~+155℃; LCSC Part Name: 10kΩ±1%62.5mW; Supplier Part: C25744; Manufacturer: UNI-ROYAL(厚声); Supplier Footprint: 0402; JLCPCB Part Class: BasicPart; Datasheet: https://atta.szlcsc.com/upload/public/pdf/source/20200306/C422600_1E6D84923E4A46A82E41ADD87F860B5C.pdf; Supplier: LCSC; Type: ThickFilmResistors; Tolerance: ±1%; Temperature Coefficient: ±100ppm/℃; Operating Temperature Range: -55℃~+155℃
R137 R138 R141 = 0402WGF1003TCE: Type:Thick Film Resistors Resistance: Tolerance:±1% Tolerance:±1% Power(Watts): Temperature Coefficient:±100ppm/℃ Temperature Coefficient:±100ppm/℃ Overload Voltage (Max): Operating Temperature Range:-55℃~+155℃ Operating Temperature Range:-55℃~+155℃; LCSC Part Name: 100kΩ±1%62.5mW; Supplier Part: C25741; Manufacturer: UNI-ROYAL(厚声); Supplier Footprint: 0402; JLCPCB Part Class: BasicPart; Datasheet: https://atta.szlcsc.com/upload/public/pdf/source/20200306/C422600_1E6D84923E4A46A82E41ADD87F860B5C.pdf; Supplier: LCSC; Type: ThickFilmResistors; Tolerance: ±1%; Temperature Coefficient: ±100ppm/℃; Operating Temperature Range: -55℃~+155℃
SWD = HDR-F_2.54_1x3P: Supplier Footprint: Through
UPDI = HDR-F_2.54_1x2P: Supplier Footprint: Through
USB = TYPE-C-F02C-1BBWC1.6: Connector Type:Type-C Gender:Female Mounting Style:Sinking plate Number of Contacts:16P Current Rating - Power (Max):5A Operating Temperature Range:-40℃~+85℃ Operating Temperature Range:-40℃~+85℃ Soldering Temperature(Max):260℃; LCSC Part Name: Type-C 母 沉板; Supplier Part: C20883026; Manufacturer: XYECONN(辛译); Supplier Footprint: SMD; JLCPCB Part Class: Extended Part; Datasheet: https://atta.szlcsc.com/upload/public/pdf/source/20240301/28CF3C13A313A955B2BAF562EF1FF25A.pdf; Supplier: LCSC; Connector Type: Type-C; Gender: Female; Mounting Style: Sinking plate; Number of Contacts: 16P; Current Rating - Power (Max): 5A; Operating Temperature Range: -40℃~+85℃; Soldering Temperature(Max): 260℃
A1 B1-B3 BOTTOM1 LEFT1 RIGHT1 TOP1 = SKRRACE010: Contact Current:50mA Voltage Rating (DC):12V Circuit:SPST Mounting Style:Brick nogging Actuator Style:Round Button With Lamp:- Mechanical Life:- Switch Length:7mm Switch Width:6.2mm Switch Height:0.6mm; LCSC Part Name: 7*6.2*0.6mm 立贴 轻触开关; Supplier Part: C139798; Manufacturer: ALPSALPINE(阿尔卑斯阿尔派); Supplier Footprint: SMD; JLCPCB Part Class: Extended Part; Datasheet: https://atta.szlcsc.com/upload/public/pdf/source/20180118/C139798_15162575632131279491.pdf; Supplier: LCSC; Contact Current: 50mA; Voltage Rating (DC): 12V; Circuit: SPST; Mounting Style: Brick nogging; Actuator Style: Round Button; Switch Length: 7mm; Switch Width: 6.2mm; Switch Height: 0.6mm
AVR = ATTINY3217-MFR: Supplier Part: C617969; Manufacturer: MICROCHIP(美国微芯); Supplier Footprint: WQFN-24-EP(4x4); JLCPCB Part Class: Extended Part; Datasheet: https://atta.szlcsc.com/upload/public/pdf/source/20221017/C07D66C14B922F573E9000C75FCA8F84.pdf; Supplier: LCSC
D4-D12 D14 D15 D17 = 1N5819WS_C191023: Reverse Voltage (Vr):40V Average Rectified Current (Io):1A Forward Voltage (Vf@If):600mV@1A; LCSC Part Name: 40V1A600mV@1A; Supplier Part: C191023; Manufacturer: Hottech(合科泰); Supplier Footprint: SOD-323; JLCPCB Part Class: BasicPart; Datasheet: https://atta.szlcsc.com/upload/public/pdf/source/20220428/3CB86FD8D28D653594B4E35F9D5AEFD9.pdf; Supplier: LCSC; Reverse Voltage (Vr): 40V; Average Rectified Current (Io): 1A; Forward Voltage (Vf@If): 600mV@1A
HOME1 VOL_DOWN VOL_UP = B3U-3000PM-B: Contact Current:50mA Voltage Rating (DC):12V Circuit:SPST Mounting Style:Surface Mount Actuator Style:Round Button With Lamp:- Mechanical Life:- Switch Length:3mm Switch Width:3.2mm Switch Height:0.7mm; LCSC Part Name: 3*3.2*0.7mm 卧贴 轻触开关; Supplier Part: C306884; Manufacturer: OMRON(欧姆龙); Supplier Footprint: SMD; JLCPCB Part Class: Extended Part; Datasheet: https://atta.szlcsc.com/upload/public/pdf/source/20180930/C306884_E0E7E375B2E6233E7BD1A69E17142907.pdf; Supplier: LCSC; Contact Current: 50mA; Voltage Rating (DC): 12V; Circuit: SPST; Mounting Style: Surface Mount; Actuator Style: Round Button; Switch Length: 3mm; Switch Width: 3.2mm; Switch Height: 0.7mm
LED7 LED8 LED10-LED13 = XL-1615RGBC-WS2812B: Emitted Color:RGB Forward Voltage (VF):3.5V~5.5V Forward Voltage (VF):3.5V~5.5V Power Dissipation:- Forward Current:5mA Dominant Wavelength:465nm~470nm；620nm~625nm；525nm~530nm Dominant Wavelength:465nm~470nm；620nm~625nm；525nm~530nm Peak Wavelength:- Lens; LCSC Part Name: 幻彩透明; Supplier Part: C5349954; Manufacturer: XINGLIGHT(成兴光); Supplier Footprint: 1615; JLCPCB Part Class: Extended Part; Datasheet: https://atta.szlcsc.com/upload/public/pdf/source/20231130/04B49B18F8461F82D29B9C7D48853943.pdf; Supplier: LCSC; Emitted Color: RGB; Forward Voltage (VF): 3.5V~5.5V; Forward Current: 5mA; Dominant Wavelength: 465nm~470nm；620nm~625nm；525nm~530nm; Lens Color: 无色透明透镜; Luminous Intensity: 110mcd；130mcd；360mcd; Viewing Angle: 120°; Mounting Sytle: 正贴; Operating Temperature: -20℃~+85℃
Q6 Q9 = AO3400A_C20917: Type: Drain Source Voltage (Vdss): Continuous Drain Current (Id): Power Dissipation (Pd): Drain Source On Resistance (RDS(on)@Vgs,Id):26.5mΩ@10V,5.7A Gate Threshold Voltage (Vgs(th)@Id):1.5V@250uA; LCSC Part Name: N沟道30V5.7A; Supplier Part: C20917; Manufacturer: AOS; Supplier Footprint: SOT-23-3L; JLCPCB Part Class: BasicPart; Datasheet: https://atta.szlcsc.com/upload/public/pdf/source/20140107/1457706668533.pdf; Supplier: LCSC; Drain Source On Resistance (RDS(on)@Vgs,Id): 26.5mΩ@10V,5.7A; Gate Threshold Voltage (Vgs(th)@Id): 1.5V@250uA
R84 = WR04W5R11FTL: Type:Thick Film Resistors Resistance: Tolerance:±1% Tolerance:±1% Power(Watts): Overload Voltage (Max): Temperature Coefficient:-200ppm/℃~+400ppm/℃ Temperature Coefficient:-200ppm/℃~+400ppm/℃ Operating Temperature Range:-55℃~+155℃ Operating Temperature Ra; LCSC Part Name: 厚膜电阻 5.11Ω ±1% 62.5mW; Supplier Part: C396142; Manufacturer: Walsin(华新科); Supplier Footprint: 0402; JLCPCB Part Class: Extended Part; Datasheet: https://atta.szlcsc.com/upload/public/pdf/source/20191217/C470037_D99261402F77DA8B1D609223749D445A.pdf; Supplier: LCSC; Type: Thick Film Resistors; Tolerance: ±1%; Temperature Coefficient: -200ppm/℃~+400ppm/℃; Operating Temperature Range: -55℃~+155℃
R87 R88 = 0402WGF4700TCE: Type:Thick Film Resistors Resistance: Tolerance:±1% Tolerance:±1% Power(Watts): Temperature Coefficient:±100ppm/℃ Temperature Coefficient:±100ppm/℃ Overload Voltage (Max): Operating Temperature Range:-55℃~+155℃ Operating Temperature Range:-55℃~+155℃; LCSC Part Name: 470Ω±1%62.5mW; Supplier Part: C25117; Manufacturer: UNI-ROYAL(厚声); Supplier Footprint: 0402; JLCPCB Part Class: BasicPart; Datasheet: https://atta.szlcsc.com/upload/public/pdf/source/20200306/C422600_1E6D84923E4A46A82E41ADD87F860B5C.pdf; Supplier: LCSC; Type: ThickFilmResistors; Tolerance: ±1%; Temperature Coefficient: ±100ppm/℃; Operating Temperature Range: -55℃~+155℃
R91-R93 = 0402WGF1001TCE: Type:Thick Film Resistors Resistance: Tolerance:±1% Tolerance:±1% Power(Watts): Temperature Coefficient:±100ppm/℃ Temperature Coefficient:±100ppm/℃ Overload Voltage (Max): Operating Temperature Range:-55℃~+155℃ Operating Temperature Range:-55℃~+155℃; LCSC Part Name: 1kΩ±1%62.5mW; Supplier Part: C11702; Manufacturer: UNI-ROYAL(厚声); Supplier Footprint: 0402; JLCPCB Part Class: BasicPart; Datasheet: https://atta.szlcsc.com/upload/public/pdf/source/20200306/C422600_1E6D84923E4A46A82E41ADD87F860B5C.pdf; Supplier: LCSC; Type: ThickFilmResistors; Tolerance: ±1%; Temperature Coefficient: ±100ppm/℃; Operating Temperature Range: -55℃~+155℃
U33 = SN74LVC1T45DBVR: Channel Type:Bi-Directional Data Rate:420Mbps Supply Voltage (VCCA):1.65V~5.5V Supply Voltage (VCCA):1.65V~5.5V Supply Voltage (VCCB):1.65V~5.5V Supply Voltage (VCCB):1.65V~5.5V Number of Circuits:1 Channels per Circuit:1 Output Type:非反相；Tri-State Operati; Supplier Part: C7843; Manufacturer: TI(德州仪器); Supplier Footprint: SOT-23-6; JLCPCB Part Class: Extended Part; Datasheet: https://www.ti.com/cn/lit/gpn/sn74lvc1t45; Supplier: LCSC; Channel Type: Bi-Directional; Data Rate: 420Mbps; Supply Voltage (VCCA): 1.65V~5.5V; Supply Voltage (VCCB): 1.65V~5.5V; Number of Circuits: 1; Channels per Circuit: 1; Output Type: 非反相；Tri-State; Operating Temperature: -40℃~+85℃
ACCEL = MPU-6500_C50278: Sensor Type:Accelerometer gyroscope Operating Temperature:-40℃~+85℃ Operating Temperature:-40℃~+85℃; Supplier Part: C50278; Manufacturer: TDK InvenSense(应美盛); Supplier Footprint: QFN-24-EP(3x3); JLCPCB Part Class: Extended Part; Datasheet: https://atta.szlcsc.com/upload/public/pdf/source/20170505/1493957890595.pdf; Supplier: LCSC; Sensor Type: Accelerometer gyroscope; Operating Temperature: -40℃~+85℃
C132 C259 C260 = CL10A226MQ8NRNC: Capacitance: Tolerance:±20% Tolerance:±20% Voltage Rated: Temperature Coefficient:; LCSC Part Name: 22uF±20%6.3V; Supplier Part: C59461; Manufacturer: SAMSUNG(三星); Supplier Footprint: 0603; JLCPCB Part Class: BasicPart; Datasheet: https://atta.szlcsc.com/upload/public/pdf/source/20160103/1457707740762.pdf; Supplier: LCSC; Tolerance: ±20%
C265 = CL05B103KB5NNNC: Capacitance: Tolerance:±10% Tolerance:±10% Voltage Rated: Temperature Coefficient:; LCSC Part Name: 10nF ±10% 50V; Supplier Part: C15195; Manufacturer: SAMSUNG(三星); Supplier Footprint: 0402; JLCPCB Part Class: Basic Part; Datasheet: https://atta.szlcsc.com/upload/public/pdf/source/20160218/1457707763339.pdf; Supplier: LCSC; Tolerance: ±10%
L15 = IP4252CZ16-8-TTL,1: Supplier Part: C458218; Manufacturer: Nexperia(安世); Supplier Footprint: UDFN-16-EP(1.4x3.3); JLCPCB Part Class: Extended Part; Datasheet: https://atta.szlcsc.com/upload/public/pdf/source/20191127/C461172_525550BE1F83C1B61EE5D9157686BE2E.pdf; Supplier: LCSC
microSD = TF-01A_C91145: Card Connection Mode:Self-bouncing Card Type:MicroSD card (TF card) Connector Type:Card Slot Additional Card Detection Pins:- Supplementary Features:With Locating Pin Maximum Body Height:1.85mm Operating Temperature Range:- Operating Temperature Range:-; LCSC Part Name: 自弹式 MicroSD卡(TF卡) 卡座; Supplier Part: C91145; Manufacturer: 韩国韩荣; Supplier Footprint: SMD; JLCPCB Part Class: Extended Part; Datasheet: https://atta.szlcsc.com/upload/public/pdf/source/20190322/C91145_63CBD6FB4639A3A3EC6A9721F18AE0FB.pdf; Supplier: LCSC; Card Connection Mode: Self-bouncing; Card Type: MicroSD card (TF card); Connector Type: Card Slot; Supplementary Features: With Locating Pin; Maximum Body Height: 1.85mm
3V3 IOVDD = TPS631000DRLR: Input Voltage:1.6V~5.5V Input Voltage:1.6V~5.5V Output Voltage:1.2V~5.3V Output Voltage:1.2V~5.3V Output Current (Max):2A Switching Frequency:2.2MHz Operating Temperature:-40℃~+125℃ Operating Temperature:-40℃~+125℃ Topology:Step-down-Boost Quiescent Curre; Supplier Part: C5219190; Manufacturer: TI(德州仪器); Supplier Footprint: SOT-583; JLCPCB Part Class: Extended Part; Datasheet: https://www.ti.com/cn/lit/gpn/tps631000; Supplier: LCSC; Input Voltage: 1.6V~5.5V; Output Voltage: 1.2V~5.3V; Output Current (Max): 2A; Switching Frequency: 2.2MHz; Operating Temperature: -40℃~+125℃; Topology: Step-down-Boost; Quiescent Current (Iq): 8uA; Switch tube (built-in/external): Built-in
5V = HX4002-MFC: Function:Charge pump Synchronous Rectification:NO Number of Outputs:1 Topology:- Input Voltage:2.7V~5.5V Input Voltage:2.7V~5.5V Output Voltage:5V Output Voltage:5V Output Current (Max):250mA Switching Frequency:1.2MHz; LCSC Part Name: 电荷泵Vin=2.7V~5.5VVout=5V250mA; Supplier Part: C172354; Manufacturer: HEXIN(禾芯微); Supplier Footprint: SOT-23-6; JLCPCB Part Class: ExtendedPart; Datasheet: https://atta.szlcsc.com/upload/public/pdf/source/20180202/C172354_15175649156801336361.pdf; Supplier: LCSC; Function: Chargepump; Synchronous Rectification: NO; Number of Outputs: 1; Input Voltage: 2.7V~5.5V; Output Current (Max): 250mA; Switching Frequency: 1.2MHz
BATT = HDR-M_2.54_1x4P: Supplier Footprint: Through
C81 C82 = CL10A106MA8NRNC: Capacitance: Tolerance:±20% Tolerance:±20% Voltage Rated: Temperature Coefficient:; LCSC Part Name: 10uF±20%25V; Supplier Part: C96446; Manufacturer: SAMSUNG(三星); Supplier Footprint: 0603; JLCPCB Part Class: BasicPart; Datasheet: https://atta.szlcsc.com/upload/public/pdf/source/20170325/1490427913016.pdf; Supplier: LCSC; Tolerance: ±20%
C83 = CL10A225KO8NNNC: Capacitance: Tolerance:±10% Tolerance:±10% Voltage Rated: Temperature Coefficient:; LCSC Part Name: 2.2uF±10%16V; Supplier Part: C23630; Manufacturer: SAMSUNG(三星); Supplier Footprint: 0603; JLCPCB Part Class: BasicPart; Datasheet: https://atta.szlcsc.com/upload/public/pdf/source/20160103/1457707709512.pdf; Supplier: LCSC; Tolerance: ±10%
C261 C262 = CL10A476MQ8QRNC: Capacitance: Tolerance:±20% Tolerance:±20% Voltage Rated: Temperature Coefficient:; LCSC Part Name: 47uF ±20% 6.3V; Supplier Part: C730416; Manufacturer: SAMSUNG(三星); Supplier Footprint: 0603; JLCPCB Part Class: Extended Part; Datasheet: https://atta.szlcsc.com/upload/public/pdf/source/20160218/1457707763339.pdf; Supplier: LCSC; Tolerance: ±20%
CHRG = MCP73832T-2ACI/OT: Supply Voltage:6V Supply Voltage:6V Maximum Charge Current:500mA Type of Battery:锂离子/Polymer Number of Cells:1 Number of Cells:1 Operating Temperature:-40℃~+85℃ Operating Temperature:-40℃~+85℃; Supplier Part: C38066; Manufacturer: MICROCHIP(美国微芯); Supplier Footprint: SOT-23-5; JLCPCB Part Class: Extended Part; Datasheet: https://atta.szlcsc.com/upload/public/pdf/source/20171228/C150772_15144473662971214910.pdf; Supplier: LCSC; Supply Voltage: 6V; Maximum Charge Current: 500mA; Type of Battery: 锂离子/Polymer; Number of Cells: 1; Operating Temperature: -40℃~+85℃
D18 = BAT60JFILM: Forward Voltage (Vf@If):580mV@1A Reverse Voltage (Vr):10V Average Rectified Current (Io):3A Reverse Leakage Current (Ir):6uA@10V; LCSC Part Name: 电压:10V 电流:3A; Supplier Part: C133103; Manufacturer: ST(意法半导体); Supplier Footprint: SOD-323; JLCPCB Part Class: Extended Part; Datasheet: https://atta.szlcsc.com/upload/public/pdf/source/20171026/C133103_15089839830161058837.pdf; Supplier: LCSC; Forward Voltage (Vf@If): 580mV@1A; Reverse Voltage (Vr): 10V; Average Rectified Current (Io): 3A; Reverse Leakage Current (Ir): 6uA@10V
D19-D21 = H5VUD5BB: polarity:Bidirectional Reverse Stand-Off Voltage (Vrwm):5V Maximum Clamping Voltage:25V Peak Pulse Current (Ipp):5A Peak Pulse Power Dissipation (Ppp):125W Breakdown Voltage:10V Reverse Leakage Current (Ir):200nA Operating Temperature:-55℃~+155℃ Operating; LCSC Part Name: 丝印:5S; Supplier Part: C20615820; Manufacturer: 宏迦橙; Supplier Footprint: SOD-523; JLCPCB Part Class: Extended Part; Datasheet: https://atta.szlcsc.com/upload/public/pdf/source/20240403/C7286ECF6740AC5EA5B85BA138DAD7E0.pdf; Supplier: LCSC; polarity: Bidirectional; Reverse Stand-Off Voltage (Vrwm): 5V; Maximum Clamping Voltage: 25V; Peak Pulse Current (Ipp): 5A; Peak Pulse Power Dissipation (Ppp): 125W; Breakdown Voltage: 10V; Reverse Leakage Current (Ir): 200nA; Operating Temperature: -55℃~+155℃; Type: ESD
Q10 = AO3401A_C15127: Type: Drain Source Voltage (Vdss): Continuous Drain Current (Id): Power Dissipation (Pd): Drain Source On Resistance (RDS(on)@Vgs,Id):44mΩ@10V,4.3A Gate Threshold Voltage (Vgs(th)@Id):1.3V@250uA; LCSC Part Name: P沟道 30V 4A; Supplier Part: C15127; Manufacturer: AOS; Supplier Footprint: SOT-23-3L; JLCPCB Part Class: Basic Part; Datasheet: https://atta.szlcsc.com/upload/public/pdf/source/20160507/1462613609053.pdf; Supplier: LCSC; Drain Source On Resistance (RDS(on)@Vgs,Id): 44mΩ@10V,4.3A; Gate Threshold Voltage (Vgs(th)@Id): 1.3V@250uA
R133 R134 = 0402WGF5113TCE: Type:Thick Film Resistors Resistance:511kΩ Tolerance:±1% Tolerance:±1% Power(Watts): Overload Voltage (Max): Temperature Coefficient:±100ppm/℃ Temperature Coefficient:±100ppm/℃ Operating Temperature Range:-55℃~+155℃ Operating Temperature Range:-55℃~+155℃; LCSC Part Name: 511kΩ ±1% 62.5mW 厚膜电阻; Supplier Part: C64042; Manufacturer: UNI-ROYAL(厚声); Supplier Footprint: 0402; JLCPCB Part Class: Extended Part; Datasheet: https://atta.szlcsc.com/upload/public/pdf/source/20200306/C422600_1E6D84923E4A46A82E41ADD87F860B5C.pdf; Supplier: LCSC; Type: Thick Film Resistors; Tolerance: ±1%; Temperature Coefficient: ±100ppm/℃; Operating Temperature Range: -55℃~+155℃
R135 R136 = 0402WGF9102TCE: Type:Thick Film Resistors Resistance:91kΩ Tolerance:±1% Tolerance:±1% Power(Watts): Overload Voltage (Max): Temperature Coefficient:±100ppm/℃ Temperature Coefficient:±100ppm/℃ Operating Temperature Range:-55℃~+155℃ Operating Temperature Range:-55℃~+155℃; LCSC Part Name: 91kΩ ±1% 62.5mW 厚膜电阻; Supplier Part: C4147; Manufacturer: UNI-ROYAL(厚声); Supplier Footprint: 0402; JLCPCB Part Class: Extended Part; Datasheet: https://atta.szlcsc.com/upload/public/pdf/source/20200306/C422600_1E6D84923E4A46A82E41ADD87F860B5C.pdf; Supplier: LCSC; Type: Thick Film Resistors; Tolerance: ±1%; Temperature Coefficient: ±100ppm/℃; Operating Temperature Range: -55℃~+155℃
R139 R140 = 0402WGF2003TCE: Type:Thick Film Resistors Resistance:200kΩ Tolerance:±1% Tolerance:±1% Power(Watts): Overload Voltage (Max): Temperature Coefficient:±100ppm/℃ Temperature Coefficient:±100ppm/℃ Operating Temperature Range:-55℃~+155℃ Operating Temperature Range:-55℃~+155℃; LCSC Part Name: 200kΩ ±1% 62.5mW 厚膜电阻; Supplier Part: C25764; Manufacturer: UNI-ROYAL(厚声); Supplier Footprint: 0402; JLCPCB Part Class: Basic Part; Datasheet: https://atta.szlcsc.com/upload/public/pdf/source/20200306/C422600_1E6D84923E4A46A82E41ADD87F860B5C.pdf; Supplier: LCSC; Type: Thick Film Resistors; Tolerance: ±1%; Temperature Coefficient: ±100ppm/℃; Operating Temperature Range: -55℃~+155℃
U46 U47 = DFE252012P-1R0M=P2: Inductance:1uH Tolerance:±20% Tolerance:±20% Current Rating:4.3A Current - Saturation(Isat):4.3A DC Resistance(DCR):42mΩ Type:- Ratings:-; LCSC Part Name: 1uH ±20% 4.3A; Supplier Part: C882955; Manufacturer: muRata(村田); Supplier Footprint: 1008; JLCPCB Part Class: Extended Part; Datasheet: https://atta.szlcsc.com/upload/public/pdf/source/20201020/C882955_448D34C20C76D68776F8F2692B40A653.pdf; Supplier: LCSC; Tolerance: ±20%; Current Rating: 4.3A; Current - Saturation(Isat): 4.3A; DC Resistance(DCR): 42mΩ
C153 C154 = 0402CG150J500NT: Capacitance: Tolerance:±5% Tolerance:±5% Voltage Rated: Temperature Coefficient:; LCSC Part Name: 15pF ±5% 50V; Supplier Part: C1548; Manufacturer: FH(风华); Supplier Footprint: 0402; JLCPCB Part Class: Basic Part; Datasheet: https://atta.szlcsc.com/upload/public/pdf/source/20200305/C486355_26A10D38EF8C2A5C37091D0039909270.pdf; Supplier: LCSC; Tolerance: ±5%
L16 = AOTA-B201610S3R3-101-T: Supplier Part: C42411119; Manufacturer: ABRACON; Supplier Footprint: 0806; JLCPCB Part Class: Extended Part; Datasheet: https://atta.szlcsc.com/upload/public/pdf/source/20241210/8ED7235334351200B2CE75E3CBC0DAAD.pdf; Supplier: LCSC
R50 R51 = 0402WGF220JTCE: Type:Thick Film Resistors Resistance: Tolerance:±1% Tolerance:±1% Power(Watts): Temperature Coefficient:±100ppm/℃ Temperature Coefficient:±100ppm/℃ Overload Voltage (Max): Operating Temperature Range:-55℃~+155℃ Operating Temperature Range:-55℃~+155℃; LCSC Part Name: 厚膜电阻 22Ω ±1% 62.5mW; Supplier Part: C25092; Manufacturer: UNI-ROYAL(厚声); Supplier Footprint: 0402; JLCPCB Part Class: Basic Part; Datasheet: https://atta.szlcsc.com/upload/public/pdf/source/20200306/C422600_1E6D84923E4A46A82E41ADD87F860B5C.pdf; Supplier: LCSC; Type: Thick Film Resistors; Tolerance: ±1%; Temperature Coefficient: ±100ppm/℃; Operating Temperature Range: -55℃~+155℃
R109 = 0402WGF330JTCE: Type:Thick Film Resistors Resistance:33Ω Tolerance:±1% Tolerance:±1% Power(Watts): Overload Voltage (Max): Temperature Coefficient:±100ppm/℃ Temperature Coefficient:±100ppm/℃ Operating Temperature Range:-55℃~+155℃ Operating Temperature Range:-55℃~+155℃; LCSC Part Name: 33Ω ±1% 62.5mW 厚膜电阻; Supplier Part: C25105; Manufacturer: UNI-ROYAL(厚声); Supplier Footprint: 0402; JLCPCB Part Class: Basic Part; Datasheet: https://atta.szlcsc.com/upload/public/pdf/source/20200306/C422600_1E6D84923E4A46A82E41ADD87F860B5C.pdf; Supplier: LCSC; Type: Thick Film Resistors; Tolerance: ±1%; Temperature Coefficient: ±100ppm/℃; Operating Temperature Range: -55℃~+155℃
RP2350B = RP2350B: Supplier Part: C9900136713; Supplier Footprint: QFN80; Supplier: LCSC
U39 = ABM8-272-T3_C20625731: LCSC Part Name: 推荐配套使用产品C20625731 ABM8-272-T3 与 C2040 RP2040; Supplier Part: C20625731; Manufacturer: ABRACON; Supplier Footprint: SMD3225-4P; JLCPCB Part Class: Extended Part; Datasheet: https://atta.szlcsc.com/upload/public/pdf/source/20240227/A8BE43F636D80F75C9AF5C59EDF21E9A.pdf; Supplier: LCSC

## Nets
3V3: 3V3.1(VOUT) ACCEL.8(VDDIO) ACCEL.13(VDD) ACCEL.22(nCS) AVR.4(VDD) C118.2 C261.2 C263.2 C265.2 D4.1(K) DISPLAY.8 R133.2 RUMBLER.2 U33.1(VCCA) U33.5(DIR)
5V: 5V.1(VOUT) C82.2 C101.2 C102.2 C104.2 C143.2 C144.2 C266.2 LED7.2(VDD) LED8.2(VDD) LED10.2(VDD) LED11.2(VDD) LED12.2(VDD) LED13.2(VDD) U33.6(VCCB)
5V_ON: 5V.3(EN) AVR.5(PA4) R48.1
DVDD: C114.2 C115.2 C210.2 C212.2 L16.2 RP2350B.10(DVDD) RP2350B.32(DVDD) RP2350B.51(DVDD) RP2350B.65(VREG_FB)
GND: 3V3.6(MODE) 3V3.7(GND) 5V.2(GND) ACCEL.9(SDO/AD0) ACCEL.11(FSYNC) ACCEL.18(GND) ACCEL.20(RESV) ACCEL.25(EP) AUDIO.6(RLIN/GPIO3) AUDIO.12(VSSD) AUDIO.18(MODE) AUDIO.24(VSSSPK) AUDIO.28(VSSA) AUDIO.33(EP) AVR.3(GND) AVR.25(GND) BATT.1 BATT.2 C81.1 C82.1 C101.1 C102.1 C104.1 C107.1 C108.1 C109.1 C110.1 C111.1 C112.1 C114.1 C115.1 C116.1 C117.1 C118.1 C121.1 C132.1 C143.1 C144.1 C153.2 C154.2 C167.1 C210.1 C211.1 C212.1 C213.2 C232.1 C233.1 C236.1 C237.2 C238.2 C239.1 C243.2 C244.2 C245.1 C246.1 C247.1 C248.1 C249.1 C250.1 C256.2 C259.1 C260.1 C261.1 C262.1 C263.1 C264.1 C265.1 C266.1 C267.2 CARTRIDGE_QSPI.1 CHRG.2(VSS) DISPLAY.1 DISPLAY.2 DISPLAY.3 DISPLAY.4 DISPLAY.25 DISPLAY.28 DISPLAY.36 IOVDD.6(MODE) IOVDD.7(GND) L15.17(EP) L18.2 L19.2 LED7.3(GND) LED8.3(GND) LED10.3(GND) LED11.3(GND) LED12.3(GND) LED13.3(GND) microSD.6(VSS) microSD.10(GND) microSD.11(GND) Q6.2(S) Q9.2(S) R48.2 R54.2 R55.2 R57.2 R58.2 R86.1 R135.1 R136.1 R139.1 R140.1 RADIO.3(RFGND) RADIO.6(SEN#) RADIO.12(GND) RADIO.21(EP) RP2350B.62(VREG_PGND) RP2350B.81(GND) SWD.2 U33.2(GND) U39.2(GND) U39.4(GND) UPDI.1 USB.A12B1(GND) USB.B12A1(GND)
VBATT: BATT.3 BATT.4 CHRG.3(VBAT) Q10.3(D)
VCC: 3V3.4(VIN) 3V3.5(EN) 5V.5(VIN) C81.2 C259.2 C260.2 D18.1(K) IOVDD.4(VIN) Q10.2(S) R138.2
VCC_SENSE: AVR.1(PA2) R138.1 R140.2
ACCEL_INT: ACCEL.12(INT) AVR.12(PB4)
AVR_INT: AVR.24(PA1) RP2350B.79(GPIO2)
BTN_1: AVR.7(PA6) D5.2(A) D9.2(A) D17.2(A)
BTN_2: AVR.9(PB7) D6.2(A) D10.2(A) D14.2(A)
BTN_3: AVR.8(PA7) D7.2(A) D11.2(A) D15.2(A)
BTN_4: AVR.19(PC2) D8.2(A) D12.2(A)
BTN_ABXY: A1.2 A1.4 AVR.11(PB5) B1.2 B1.4 B2.2 B2.4 B3.2 B3.4
BTN_CTRL: AVR.10(PB6) HOME1.1 VOL_DOWN.2 VOL_UP.2
BTN_DPAD: AVR.21(PC4) BOTTOM1.2 BOTTOM1.4 LEFT1.2 LEFT1.4 RIGHT1.2 RIGHT1.4 TOP1.2 TOP1.4
CHARGING: AVR.6(PA5) CHRG.1(STAT) R137.1 R139.2
DB_0: DISPLAY.24 RP2350B.44(GPIO35)
DB_1: DISPLAY.23 RP2350B.43(GPIO34)
DB_2: DISPLAY.22 RP2350B.42(GPIO33)
DB_3: DISPLAY.21 RP2350B.40(GPIO32)
DB_4: DISPLAY.20 RP2350B.39(GPIO31)
DB_5: DISPLAY.19 RP2350B.38(GPIO30)
DB_6: DISPLAY.18 RP2350B.37(GPIO29)
DB_7: DISPLAY.17 RP2350B.36(GPIO28)
DB_8: DISPLAY.16 RP2350B.28(GPIO27)
DB_9: DISPLAY.15 RP2350B.27(GPIO26)
DB_10: DISPLAY.14 RP2350B.26(GPIO25)
DB_11: DISPLAY.13 RP2350B.25(GPIO24)
DB_12: DISPLAY.12 RP2350B.23(GPIO23)
DB_13: DISPLAY.11 RP2350B.22(GPIO22)
DB_14: DISPLAY.10 RP2350B.21(GPIO21)
DB_15: DISPLAY.9 RP2350B.20(GPIO20)
DISP_CSX: DISPLAY.32 RP2350B.47(GPIO38)
DISP_DCX: DISPLAY.31 RP2350B.46(GPIO37)
DISP_LED_K: DISPLAY.5 DISPLAY.6 DISPLAY.7 R84.1
DISP_RDX: DISPLAY.29
DISP_TE: DISPLAY.33 RP2350B.48(GPIO39)
DISP_WRX: DISPLAY.30 RP2350B.45(GPIO36)
EMBEDDED_ANTENNA: FMA1.1 L19.1 L25.1
GPIO_11: RP2350B.9(GPIO11)
GPIO_12: CARTRIDGE_HSTX.2 RP2350B.11(GPIO12)
GPIO_13: CARTRIDGE_HSTX.3 RP2350B.12(GPIO13)
GPIO_14: CARTRIDGE_HSTX.4 RP2350B.13(GPIO14)
GPIO_15: CARTRIDGE_HSTX.5 RP2350B.14(GPIO15)
GPIO_16: CARTRIDGE_HSTX.6 RP2350B.16(GPIO16)
GPIO_17: CARTRIDGE_HSTX.7 RP2350B.17(GPIO17)
GPIO_18: CARTRIDGE_HSTX.8 RP2350B.18(GPIO18)
GPIO_19: CARTRIDGE_HSTX.9 RP2350B.19(GPIO19)
GPIO_46: CARTRIDGE_QSPI.9 RP2350B.57(GPIO46_ADC6)
GPIO_47: CARTRIDGE_QSPI.8 RP2350B.58(GPIO47_ADC7)
HEADSET_ANTENNA: C242.2 L24.2
HEADSET_DETECT: AUDIO.3(LLIN/GPIO2) L21.2 R141.2 RP2350B.7(GPIO9)
HEADSET_LEFT: AUDIO.30(LHP) C199.2
HEADSET_RIGHT: AUDIO.29(RHP) C200.2
I2C_SCL: ACCEL.23(SCL/SCLK) AVR.16(PB0) R45.1 R131.2 RADIO.7(SCLK) RP2350B.78(GPIO1) TP7.1
I2C_SDA: ACCEL.24(SDA/SDI) AVR.15(PB1) R46.1 R130.2 RADIO.8(SDIO) RP2350B.77(GPIO0) TP6.1
I2S_BCLK: AUDIO.8(BCLK) RP2350B.4(GPIO7)
I2S_DIN: AUDIO.10(DACIN) RP2350B.2(GPIO5)
I2S_DOUT: AUDIO.9(ADCOUT) RP2350B.3(GPIO6)
I2S_LRCLK: AUDIO.7(FS) RP2350B.6(GPIO8)
I2S_MCLK: AUDIO.11(MCLK) RP2350B.1(GPIO4)
IOVDD: AUDIO.13(VDDC) AUDIO.14(VDDB) AUDIO.26(VDDSPK) AUDIO.31(VDDA) C107.2 C108.2 C109.2 C110.2 C111.2 C112.2 C116.2 C117.2 C132.2 C167.2 C211.2 C236.2 C237.1 C245.2 C246.2 C248.2 C249.2 C262.2 CARTRIDGE_HSTX.1 DISPLAY.34 DISPLAY.35 IOVDD.1(VOUT) microSD.4(VDD) R45.2 R46.2 R56.2 R76.1 R109.1 R128.2 R134.2 R141.1 RADIO.10(VD) RADIO.11(VA) RP2350B.5(IOVDD) RP2350B.15(IOVDD) RP2350B.24(IOVDD) RP2350B.29(IOVDD) RP2350B.35(RUN) RP2350B.41(IOVDD) RP2350B.50(IOVDD) RP2350B.59(ADC_AVDD) RP2350B.60(IOVDD) RP2350B.64(VREG_VIN) RP2350B.68(USB_OTP_VDD) RP2350B.69(QSPI_IOVDD) RP2350B.76(IOVDD)
IOVDD_EN: AVR.18(PC1) IOVDD.5(EN)
PWM_BACKLIGHT: AVR.17(PC0) R92.2
PWM_RUMBLER: AVR.2(EXTCLK/PA3) R91.2
QSPI_SCLK: CARTRIDGE_QSPI.6 RP2350B.71(QSPI_SCLK)
QSPI_SD0: CARTRIDGE_QSPI.5 RP2350B.72(QSPI_SD0)
QSPI_SD1: CARTRIDGE_QSPI.3 RP2350B.74(QSPI_SD1)
QSPI_SD2: CARTRIDGE_QSPI.4 RP2350B.73(QSPI_SD2)
QSPI_SD3: CARTRIDGE_QSPI.7 RP2350B.70(QSPI_SD3)
QSPI_SS: AVR.22(PC5) CARTRIDGE_QSPI.2 R56.1 RP2350B.75(QSPI_SS)
RADIO_INT: RADIO.18(GPO2/[INT#]) RP2350B.80(GPIO3) TP4.1
RADIO_L: C251.1 RADIO.14(LOUT/[DFS])
RADIO_R: C209.1 RADIO.13(ROUT/[DOUT])
RADIO_RESET: AUDIO.15(CSB/GPIO1) RADIO.5(RST#)
RGB: AVR.20(PC3) U33.3(A)
RPI_SWCLK: RP2350B.33(SWCLK) SWD.1
RPI_SWD: RP2350B.34(SWDIO) SWD.3
SD_CSN: L15.2(IN2) RP2350B.55(GPIO44_ADC4)
SD_RX: L15.3(IN3) RP2350B.54(GPIO43_ADC3)
SD_SCK: L15.5(IN5) RP2350B.52(GPIO41_ADC1)
SD_TX: L15.4(IN4) RP2350B.53(GPIO42_ADC2)
SDIO_1: L15.6(IN6) RP2350B.49(GPIO40_ADC0)
SDIO_2: L15.1(IN1) RP2350B.56(GPIO45_ADC5)
SPEAKER_LEFT: AUDIO.25(LSPKOUT) SPEAKER1.2
SPEAKER_RIGHT: AUDIO.23(RSPKOUT) SPEAKER1.1
UPDI: AVR.23(PA0/RESET#/UPDI) UPDI.2
USB_DM: R50.1 USB.A7(DN1) USB.B7(DN2)
USB_DP: R51.1 USB.A6(DP1) USB.B6(DP2)
VREG_AVDD: C213.1 R109.2 RP2350B.61(VREG_AVDD)
VREG_LX: L16.1 RP2350B.63(VREG_LX)
VUSB: C121.2 CHRG.4(VDD) D18.2(A) Q10.1(G) R137.2 USB.A9B4(VBUS) USB.B9A4(VBUS)
XIN: C153.1 RP2350B.30(XIN) U39.1
XOUT: R93.1 RP2350B.31(XOUT)
$1N1000: 5V.4(C-) C83.1
$1N1001: 5V.6(C+) C83.2
$1N84601: CHRG.5(PROG) R86.2
$1N105936: 3V3.2(LX2) U46.2
$1N105940: 3V3.3(LX1) U46.1
$1N105961: 3V3.8(FB) R133.1 R135.2
$1N106152: IOVDD.2(LX2) U47.2
$1N106156: IOVDD.3(LX1) U47.1
$1N106225: IOVDD.8(FB) R134.1 R136.2
$2N19576: L15.14(OUT3) microSD.7(DAT0(D0)) R76.2
$2N25545: L15.16(OUT1) microSD.1(DAT2(RSV))
$2N25554: L15.15(OUT2) microSD.2(CDDAT3(CS))
$2N25581: L15.13(OUT4) microSD.3(CMD(DI))
$2N25588: L15.12(OUT5) microSD.5(CLK(SCLK))
$2N25598: L15.11(OUT6) microSD.8(DAT1(RSV))
$2N43437: ACCEL.10(REGOUT) C264.2
$3N73781: C239.2 RADIO.17(GPO3/[DCLK]) X2.2
$3N78093: RADIO.19(GPO1) TP5.1
$3N91282: AUDIO.20(RAUXIN) C209.2
$3N91283: AUDIO.19(LAUXIN) C251.2
$3N91285: AUDIO.27(VREF) C247.2
$3N91286: AUDIO.32(MICBIAS) C250.2 R132.2
$3N91292: C254.2 MIC.1(+) R132.1
$3N91301: C255.2 MIC.2(-)
$3N93413: AUDIO.17(SDIO) C244.1 R130.1
$3N93472: AUDIO.16(SCLK) C243.1 R131.1
$3N94514: AUDIO.1(LMICP) C254.1
$3N94519: AUDIO.2(LMICN) C255.1
$3N94853: C238.1 RADIO.9(RCLK) X2.1
$3N94920: C256.1 L24.1 RADIO.2(FMI)
$3N116814: C267.1 L25.2 RADIO.4(LPI)
$4N10766: D8.1(K) RIGHT1.1 RIGHT1.3
$4N10774: D7.1(K) TOP1.1 TOP1.3
$4N10782: D6.1(K) LEFT1.1 LEFT1.3
$4N10794: BOTTOM1.1 BOTTOM1.3 D5.1(K)
$4N10842: D15.1(K) VOL_DOWN.1
$4N10903: B1.1 B1.3 D9.1(K)
$4N10915: A1.1 A1.3 D10.1(K)
$4N17155: D14.1(K) VOL_UP.1
$4N18597: B3.1 B3.3 D12.1(K)
$4N18613: B2.1 B2.3 D11.1(K)
$4N38253: Q6.3(D) R84.2
$4N49584: LED7.1(DO) LED8.4(DI)
$4N49861: LED10.1(DO) LED11.4(DI)
$4N49881: LED11.1(DO) LED12.4(DI)
$4N49891: LED7.4(DI) LED12.1(DO)
$4N50022: R87.1 U33.4(B)
$4N50025: LED13.4(DI) R87.2
$4N50031: LED8.1(DO) R88.1
$4N56569: D4.2(A) Q9.3(D) RUMBLER.1
$4N56605: Q9.1(G) R54.1 R91.1
$4N56656: Q6.1(G) R55.1 R92.1
$4N78796: D17.1(K) HOME1.2
$4N81859: AVR.13(PB3/TOSC1) C232.2 X1.1
$4N81864: AVR.14(PB2/TOSC2) C233.2 X1.2
$4N167601: LED10.4(DI) LED13.1(DO)
$6N10559: R57.1 USB.B5(CC2)
$6N10563: R58.1 USB.A5(CC1)
$6N22141: DISPLAY.26 R128.1
$6N37493: C242.1 HEADSET1.1 L18.1
$6N37494: HEADSET1.2 L21.1
$6N37501: HEADSET1.3 L23.1
$6N37502: C200.1 L23.2
$6N37503: HEADSET1.4 L22.1
$6N37504: C199.1 L22.2
$7N680: R51.2 RP2350B.67(USB_DP)
$7N687: R50.2 RP2350B.66(USB_DM)
$7N1009: C154.1 R93.2 U39.3

Not connected (* = marked no-connect by the designer): ACCEL 1(NC) 2(NC) 3(NC) 4(NC) 5(NC) 6(NC) 7(AUX_CL) 14(NC) 15(NC) 16(NC) 17(NC) 19(RESV) 21(AUX_DA); AUDIO 4(RMICP) 5(RMICN) 21(AUXOUT1) 22(AUXOUT2); D19 1 2; D20 1 2; D21 1 2; DISPLAY 27 37 38 39 40 41 42; H4 1 2; H5 1 2; H6 1 2; HEADSET1 5 6; L15 7(IN7) 8(IN8) 9(OUT8) 10(OUT7); microSD 9(CD) 12(GND) 13(GND); R88 2; RADIO 1(NC) 15(DOUT) 16(DFS) 20(NC); RP2350B 8(GPIO10); USB 13(EH) 14(EH) 15(EH) 16(EH) A8(SBU1) B8(SBU2)
